# EAGLE schematic hw_DAA (EAGLE 7.6.0), part 2 of 4
## Sheet 14 of 34: SYSMON and PS Config
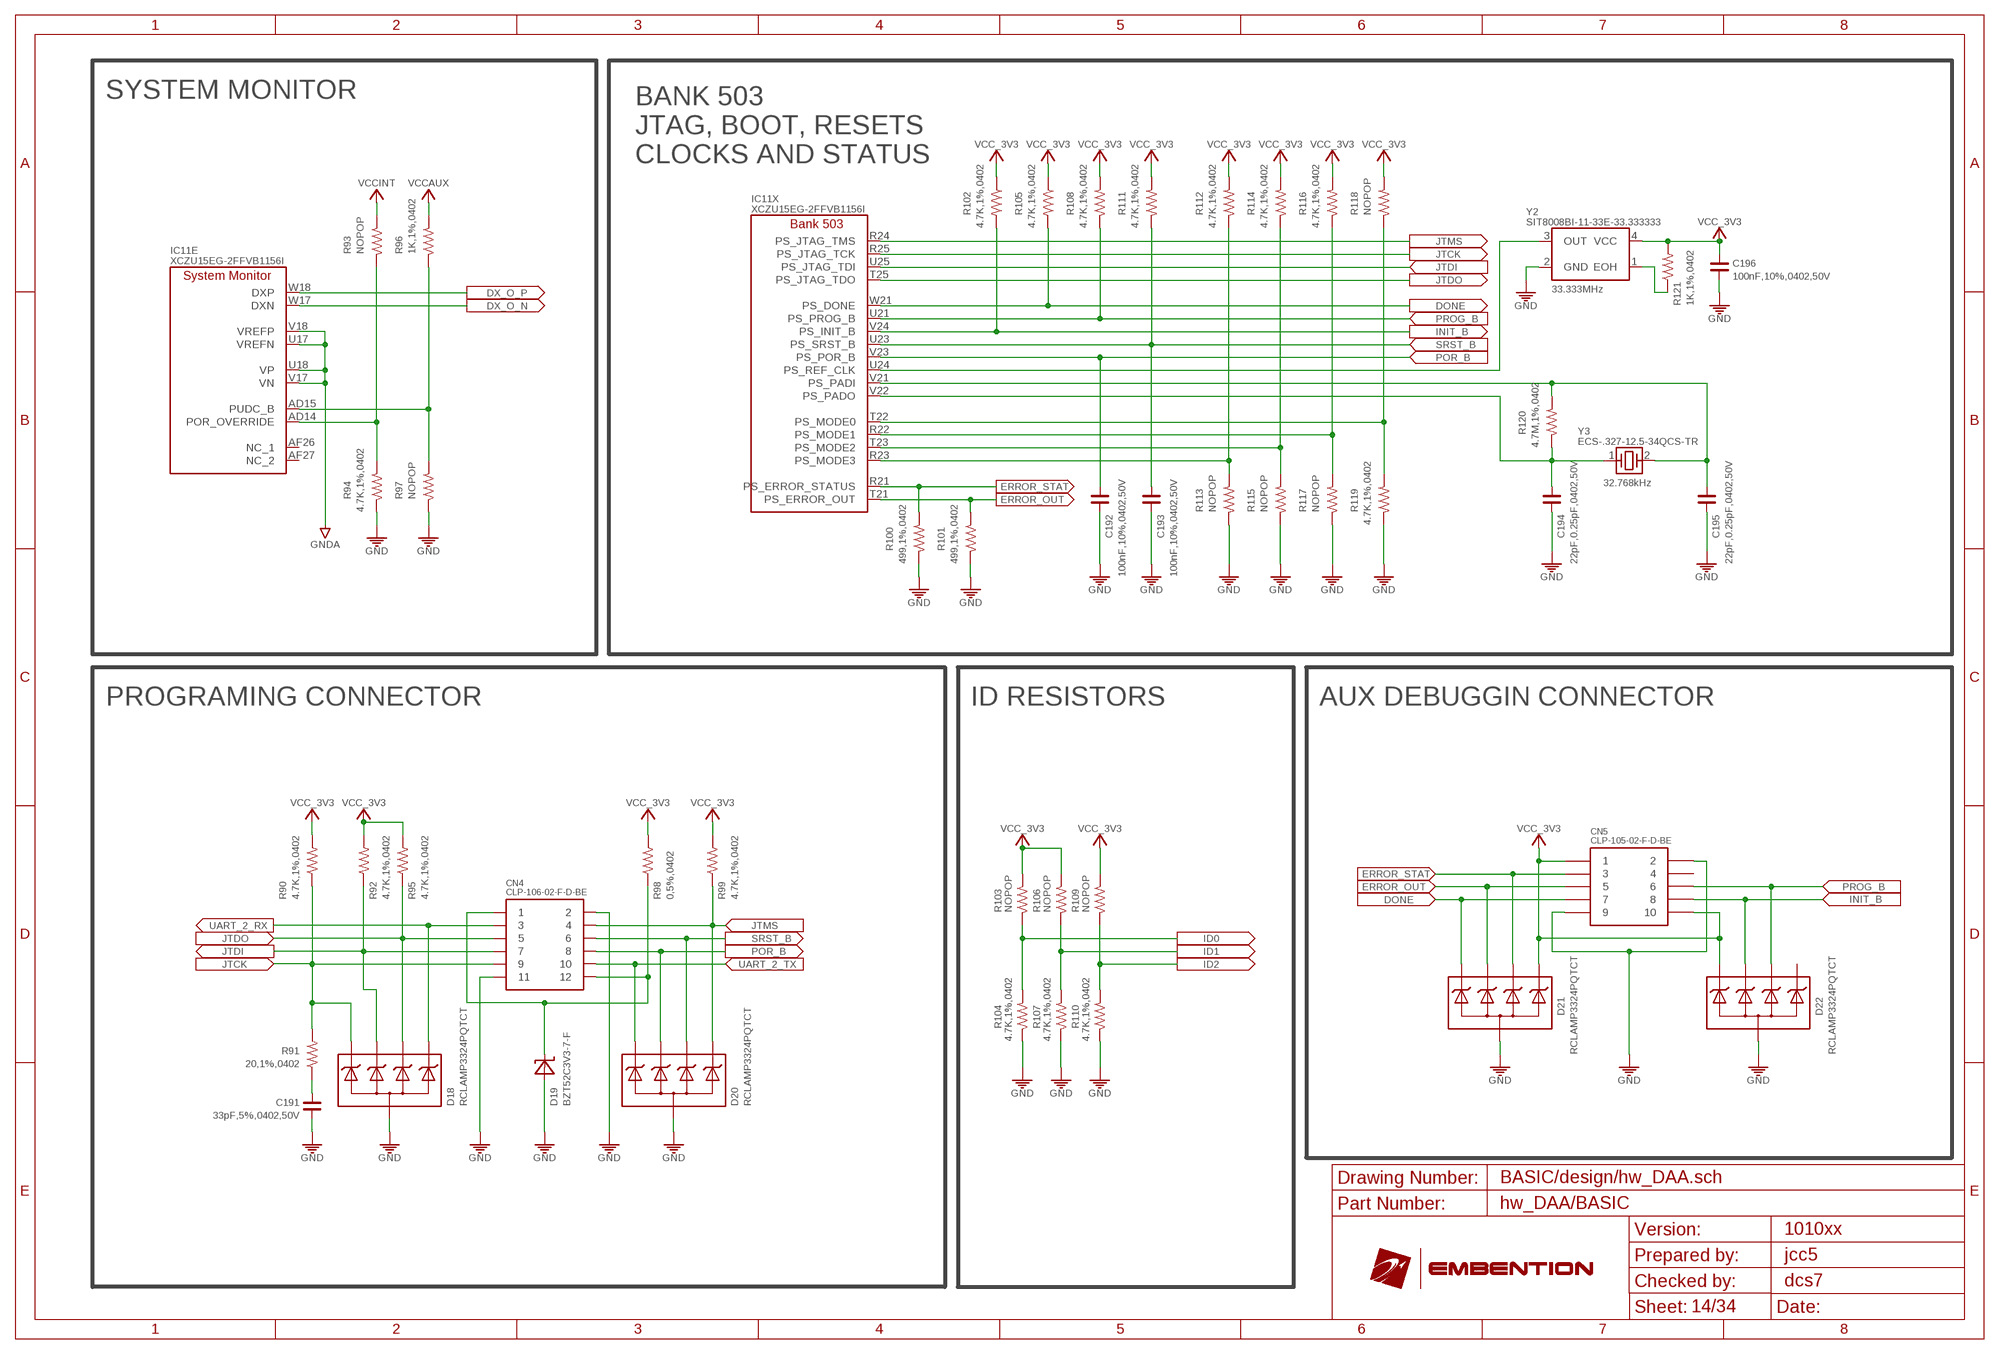
[diagram p13: schematic, sheet 14]

### Parts
C191  33pF,5%,0402,50V  C_0402  [C0402]
C192  100nF,10%,0402,50V  C_0402  [C0402]
C193  100nF,10%,0402,50V  C_0402  [C0402]
C194  22pF,0.25pF,0402,50V  C_0402  [C0402]
C195  22pF,0.25pF,0402,50V  C_0402  [C0402]
C196  100nF,10%,0402,50V  C_0402  [C0402]
CN4  CLP-106-02-F-D-BE  [CLP-106-02-X-D-BE]
CN5  CLP-105-02-F-D-BE  [CLP-105-02-X-D-BE]
D18  RCLAMP3324PQTCT  [USON-10]
D19  BZT52C3V3-7-F  [SOD123]
D20  RCLAMP3324PQTCT  [USON-10]
D21  RCLAMP3324PQTCT  [USON-10]
D22  RCLAMP3324PQTCT  [USON-10]
R90  4.7K,1%,0402  R_0402  [R0402]
R91  20,1%,0402  R_0402  [R0402]
R92  4.7K,1%,0402  R_0402  [R0402]
R93  NOPOP  R_0402  [R0402]
R94  4.7K,1%,0402  R_0402  [R0402]
R95  4.7K,1%,0402  R_0402  [R0402]
R96  1K,1%,0402  R_0402  [R0402]
R97  NOPOP  R_0402  [R0402]
R98  0,5%,0402  R_0402  [R0402]
R99  4.7K,1%,0402  R_0402  [R0402]
R100  499,1%,0402  R_0402  [R0402]
R101  499,1%,0402  R_0402  [R0402]
R102  4.7K,1%,0402  R_0402  [R0402]
R103  NOPOP  R_0402  [R0402]
R104  4.7K,1%,0402  R_0402  [R0402]
R105  4.7K,1%,0402  R_0402  [R0402]
R106  NOPOP  R_0402  [R0402]
R107  4.7K,1%,0402  R_0402  [R0402]
R108  4.7K,1%,0402  R_0402  [R0402]
R109  NOPOP  R_0402  [R0402]
R110  4.7K,1%,0402  R_0402  [R0402]
R111  4.7K,1%,0402  R_0402  [R0402]
R112  4.7K,1%,0402  R_0402  [R0402]
R113  NOPOP  R_0402  [R0402]
R114  4.7K,1%,0402  R_0402  [R0402]
R115  NOPOP  R_0402  [R0402]
R116  4.7K,1%,0402  R_0402  [R0402]
R117  NOPOP  R_0402  [R0402]
R118  NOPOP  R_0402  [R0402]
R119  4.7K,1%,0402  R_0402  [R0402]
R120  4.7M,1%,0402  R_0402  [R0402]
R121  1K,1%,0402  R_0402  [R0402]
Y2  SIT8008BI-11-33E-33.333333  [2.5X2]
Y3  ECS-.327-12.5-34QCS-TR  [3.2X1.5]

### Nets
+3V3_JTAG: CN4.1 CN4.12 D19.C R98.1
DONE: CN5.7 D21.1 D21.10 IC11.W21(X:PS_DONE) R105.2
DX_O_N [TEMP]: IC11.W17(E:DXN) ; also sheet 15
DX_O_P [TEMP]: IC11.W18(E:DXP) ; also sheet 15
ERROR_OUT: CN5.5 D21.2 D21.9 IC11.T21(X:PS_ERROR_OUT) R101.2
ERROR_STAT: CN5.3 D21.4 D21.7 IC11.R21(X:PS_ERROR_STATUS) R100.2
GND: C191.2 C192.2 C193.2 C194.2 C195.2 C196.2 CN4.2 CN4.11 CN5.2 CN5.9 D18.3 D18.8 D18.38 D19.A D20.3 D20.8 D20.38 D21.3 D21.8 D21.38 D22.3 D22.8 D22.38 R94.1 R97.1 R100.1 R101.1 R104.1 R107.1 R110.1 R113.1 R115.1 R117.1 R119.1 Y2.2(GND) ; also sheet 2,3,4,5,6,7,8,9,10,11,12,13,15,17,18,20,21,22,23,24,25,26,27,28,29,30,31,32,33
GNDA: IC11.U17(E:VREFN) IC11.U18(E:VP) IC11.V17(E:VN) IC11.V18(E:VREFP) ; also sheet 11,12,13
ID0: R103.1 R104.2 ; also sheet 19
ID1: R106.1 R107.2 ; also sheet 19
ID2: R109.1 R110.2 ; also sheet 19
INIT_B: CN5.8 D22.2 D22.9 IC11.V24(X:PS_INIT_B) R102.2
JTCK: CN4.9 D18.1 D18.10 IC11.R25(X:PS_JTAG_TCK) R90.1 R91.2
JTDI: CN4.7 D18.2 D18.9 IC11.U25(X:PS_JTAG_TDI) R92.1
JTDO: CN4.5 D18.4 D18.7 IC11.T25(X:PS_JTAG_TDO) R95.1
JTMS: CN4.4 D20.5 D20.6 IC11.R24(X:PS_JTAG_TMS) R99.1
MODE0: IC11.T22(X:PS_MODE0) R118.1 R119.2
MODE1: IC11.R22(X:PS_MODE1) R116.1 R117.2
MODE2: IC11.T23(X:PS_MODE2) R114.1 R115.2
MODE3: IC11.R23(X:PS_MODE3) R112.1 R113.2
N$88: R121.1 Y2.1(EOH)
N$90: C191.1 R91.1
PADI: C195.1 IC11.V21(X:PS_PADI) R120.2 Y3.2(X2)
PADO: C194.1 IC11.V22(X:PS_PADO) R120.1 Y3.1(X1)
POR_B: C192.1 CN4.8 D20.2 D20.9 IC11.V23(X:PS_POR_B) ; also sheet 15
POR_OVERRIDE: IC11.AD14(E:POR_OVERRIDE) R93.1 R94.2
PROG_B: CN5.6 D22.4 D22.7 IC11.U21(X:PS_PROG_B) R108.1
PUDC_B: IC11.AD15(E:PUDC_B) R96.1 R97.2
REF_CLK: IC11.U24(X:PS_REF_CLK) Y2.3(OUT)
SRST_B: C193.1 CN4.6 D20.4 D20.7 IC11.U23(X:PS_SRST_B) R111.1
UART_2_RX: CN4.3 D18.5 D18.6 ; also sheet 17
UART_2_TX: CN4.10 D20.1 D20.10 ; also sheet 17
VCC_3V3: C196.1 CN5.1 CN5.10 D21.5 D21.6 D22.1 D22.10 R90.2 R92.2 R95.2 R98.2 R99.2 R102.1 R103.2 R105.1 R106.2 R108.2 R109.2 R111.2 R112.2 R114.2 R116.2 R118.2 R121.2 Y2.4(VCC) ; also sheet 5,11,12,15
VCCAUX: R96.2 ; also sheet 5,11,12,15
VCCINT: R93.2 ; also sheet 7,11,12
Unconnected: CN5.4 D22.5 D22.6 IC11.AF26(E:NC_1) IC11.AF27(E:NC_2)

### Notes on the sheet
- SYSTEM MONITOR
- BANK 503
  JTAG, BOOT, RESETS
  CLOCKS AND STATUS
- 33.333MHz
- 32.768kHz
- PROGRAMING CONNECTOR | ID RESISTORS | AUX DEBUGGIN CONNECTOR
- BASIC/design/hw_DAA.sch
- hw_DAA/BASIC
- 1010xx
- jcc5
- dcs7

## Sheet 15 of 34: Temperature and Reset
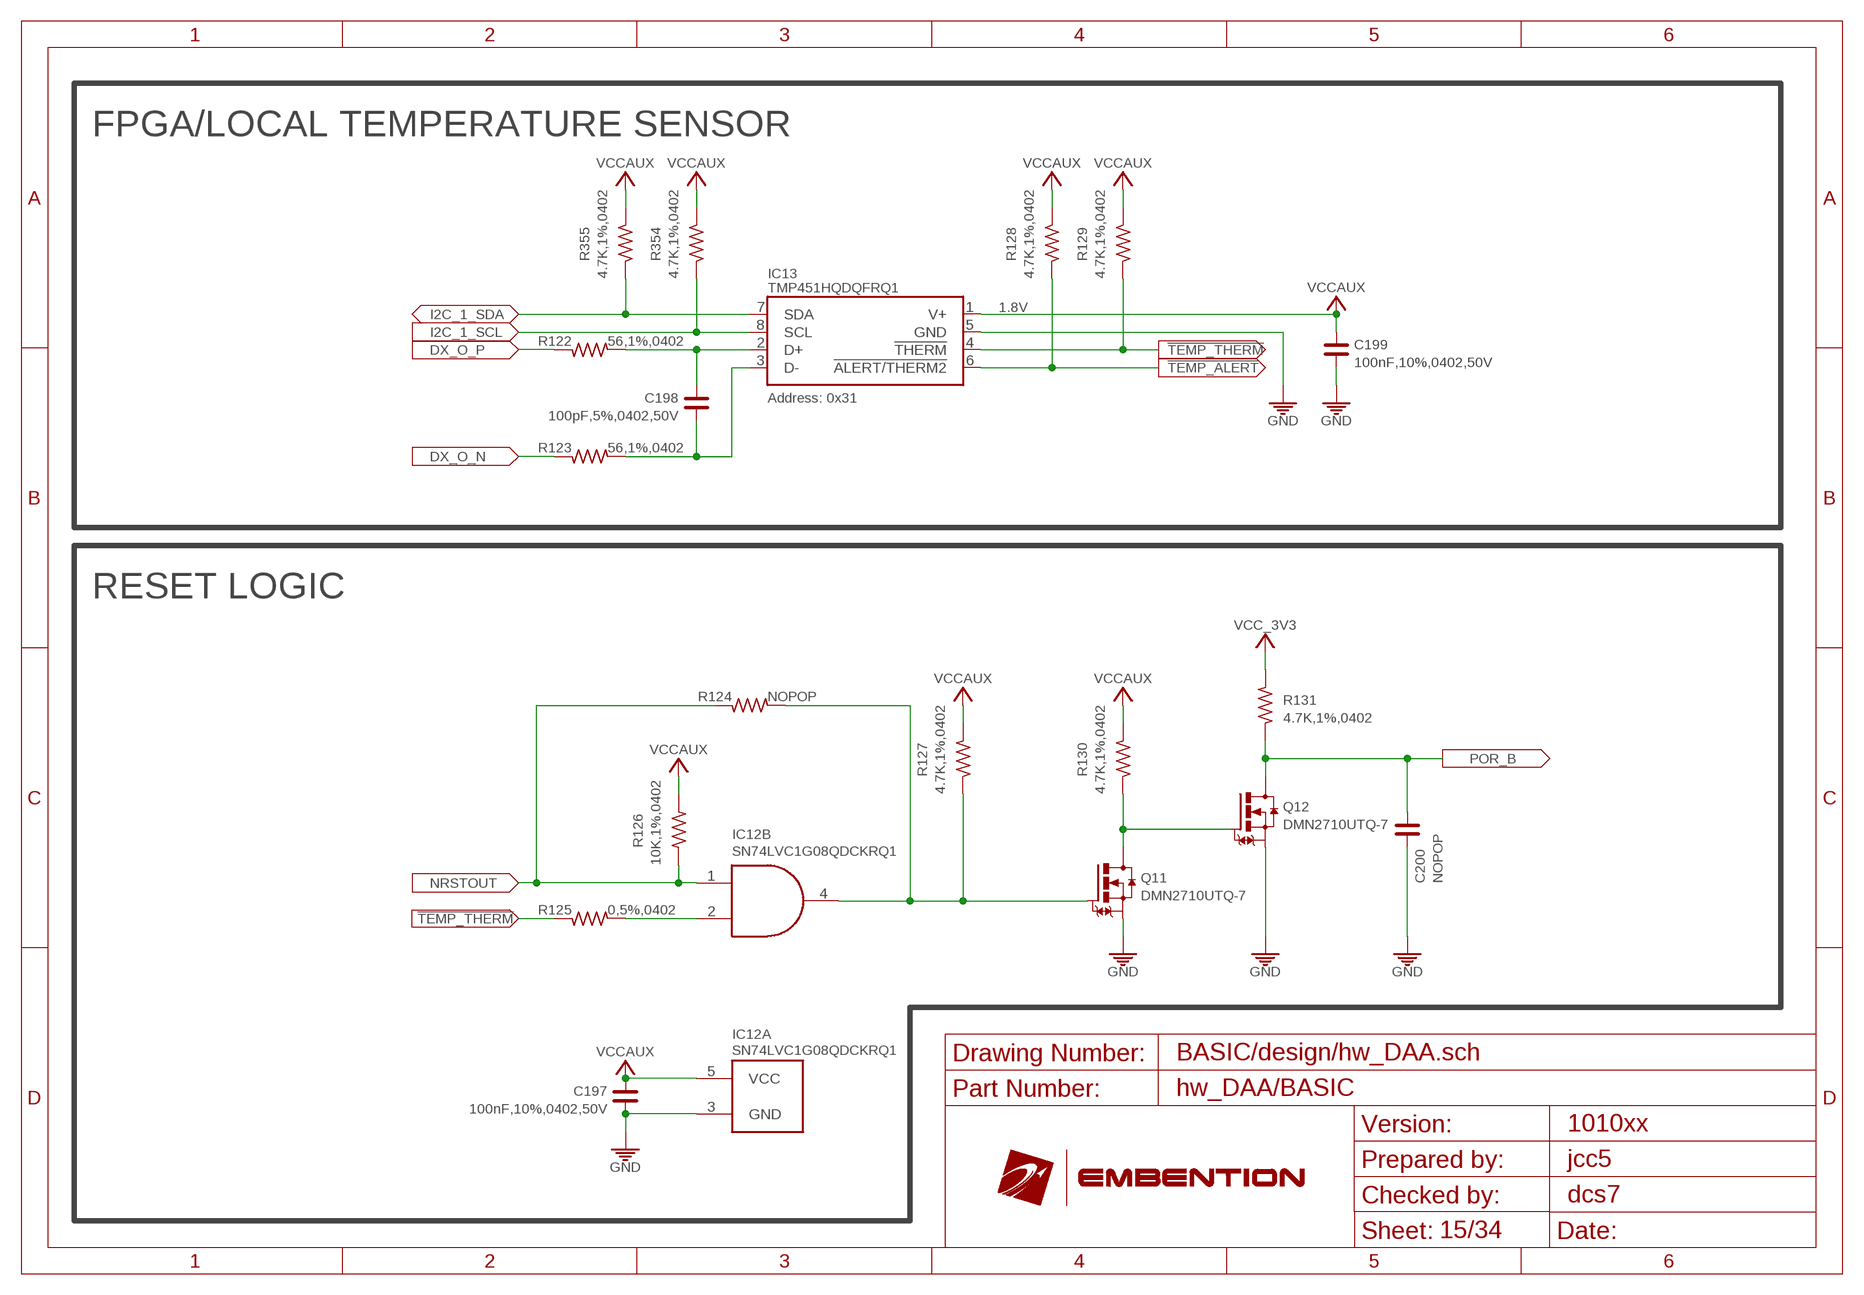
[diagram p14: schematic, sheet 15]

### Parts
C197  100nF,10%,0402,50V  C_0402  [C0402]
C198  100pF,5%,0402,50V  C_0402  [C0402]
C199  100nF,10%,0402,50V  C_0402  [C0402]
C200  NOPOP  C_0402  [C0402]
IC12  SN74LVC1G08QDCKRQ1  [DCK5]
IC13  TMP451HQDQFRQ1  TMP451-Q1  [WSON-8]
Q11  DMN2710UTQ-7  [SOT-523]
Q12  DMN2710UTQ-7  [SOT-523]
R122  56,1%,0402  R_0402  [R0402]
R123  56,1%,0402  R_0402  [R0402]
R124  NOPOP  R_0402  [R0402]
R125  0,5%,0402  R_0402  [R0402]
R126  10K,1%,0402  R_0402  [R0402]
R127  4.7K,1%,0402  R_0402  [R0402]
R128  4.7K,1%,0402  R_0402  [R0402]
R129  4.7K,1%,0402  R_0402  [R0402]
R130  4.7K,1%,0402  R_0402  [R0402]
R131  4.7K,1%,0402  R_0402  [R0402]
R354  4.7K,1%,0402  R_0402  [R0402]
R355  4.7K,1%,0402  R_0402  [R0402]

### Nets
!TEMP_ALERT: IC13.6(!ALERT/THERM2) R128.1 ; also sheet 17
!TEMP_THERM: IC13.4(!THERM) R125.1 R129.1
DX_I_N [TEMP]: C198.2 IC13.3(D-) R123.2
DX_I_P [TEMP]: C198.1 IC13.2(D+) R122.2
DX_O_N [TEMP]: R123.1 ; also sheet 14
DX_O_P [TEMP]: R122.1 ; also sheet 14
GND: C197.2 C199.2 C200.2 IC12.3(A:GND) IC13.5(GND) Q11.2(S) Q12.2(S) ; also sheet 2,3,4,5,6,7,8,9,10,11,12,13,14,17,18,20,21,22,23,24,25,26,27,28,29,30,31,32,33
I2C_1_SCL: IC13.8(SCL) R354.1 ; also sheet 19
I2C_1_SDA: IC13.7(SDA) R355.1 ; also sheet 19
N$18: IC12.2(B:B) R125.2
N$54: Q11.3(D) Q12.1(G) R130.1
N$131: IC12.4(B:Y) Q11.1(G) R124.2 R127.1
NRSTOUT: IC12.1(B:A) R124.1 R126.2 ; also sheet 5,6
POR_B: C200.1 Q12.3(D) R131.2 ; also sheet 14
VCC_3V3: R131.1 ; also sheet 5,11,12,14
VCCAUX: C197.1 C199.1 IC12.5(A:VCC) IC13.1(V+) R126.1 R127.2 R128.2 R129.2 R130.2 R354.2 R355.2 ; also sheet 5,11,12,14

### Notes on the sheet
- FPGA/LOCAL TEMPERATURE SENSOR
- 1.8V
- Address: 0x31
- RESET LOGIC
- BASIC/design/hw_DAA.sch
- hw_DAA/BASIC
- 1010xx
- jcc5
- dcs7

## Sheet 16 of 34: PL High Density Banks
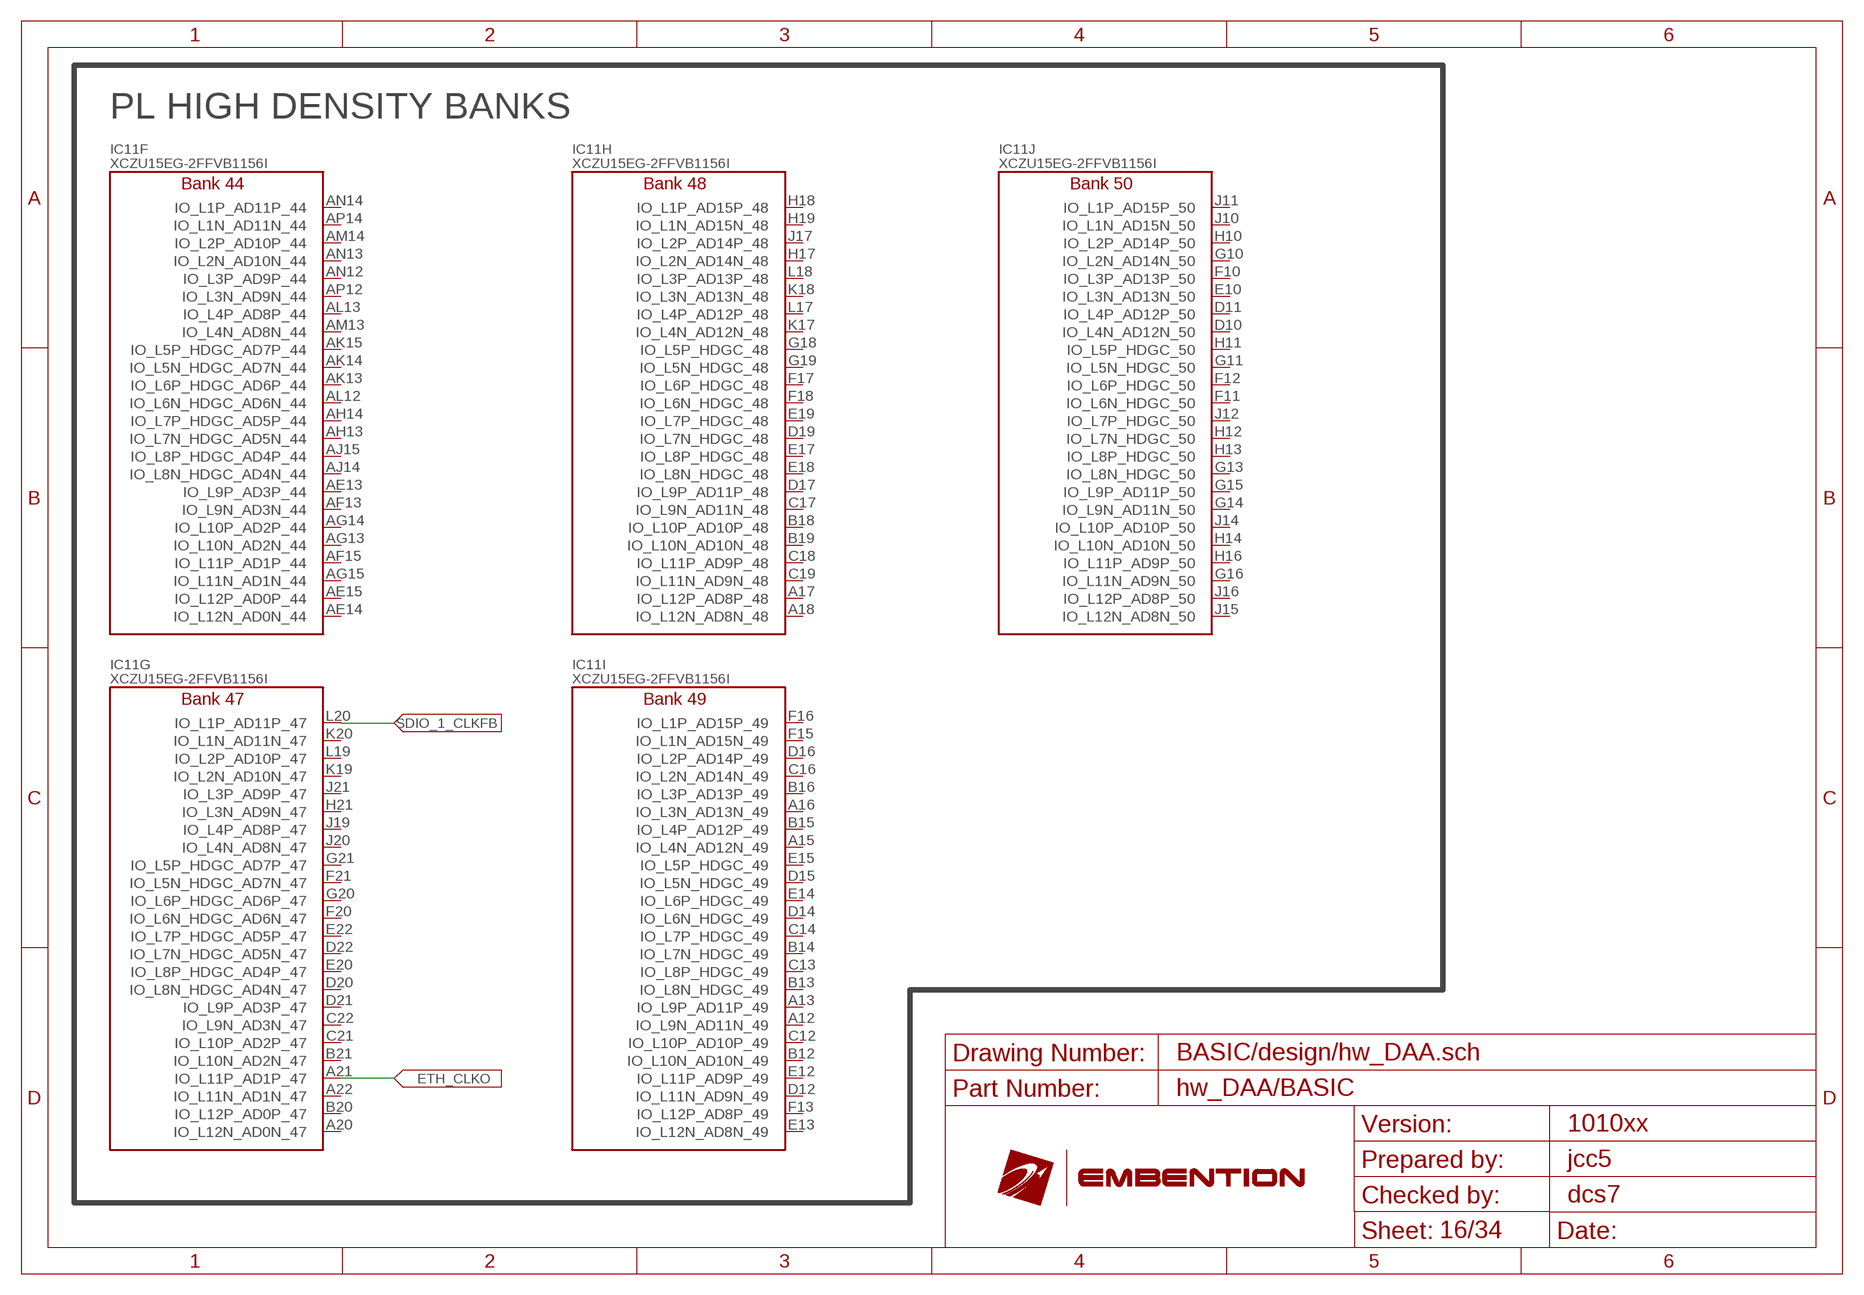
[diagram p15: schematic, sheet 16]

### Nets
ETH_CLKO: IC11.A21(G:IO_L11P_AD1P_47) ; also sheet 27
SDIO_1_CLKFB: IC11.L20(G:IO_L1P_AD11P_47) ; also sheet 24
Unconnected: IC11.A12(I:IO_L9N_AD11N_49) IC11.A13(I:IO_L9P_AD11P_49) IC11.A15(I:IO_L4N_AD12N_49) IC11.A16(I:IO_L3N_AD13N_49) IC11.A17(H:IO_L12P_AD8P_48) IC11.A18(H:IO_L12N_AD8N_48) IC11.A20(G:IO_L12N_AD0N_47) IC11.A22(G:IO_L11N_AD1N_47) IC11.AE13(F:IO_L9P_AD3P_44) IC11.AE14(F:IO_L12N_AD0N_44) IC11.AE15(F:IO_L12P_AD0P_44) IC11.AF13(F:IO_L9N_AD3N_44) IC11.AF15(F:IO_L11P_AD1P_44) IC11.AG13(F:IO_L10N_AD2N_44) IC11.AG14(F:IO_L10P_AD2P_44) IC11.AG15(F:IO_L11N_AD1N_44) IC11.AH13(F:IO_L7N_HDGC_AD5N_44) IC11.AH14(F:IO_L7P_HDGC_AD5P_44) IC11.AJ14(F:IO_L8N_HDGC_AD4N_44) IC11.AJ15(F:IO_L8P_HDGC_AD4P_44) IC11.AK13(F:IO_L6P_HDGC_AD6P_44) IC11.AK14(F:IO_L5N_HDGC_AD7N_44) IC11.AK15(F:IO_L5P_HDGC_AD7P_44) IC11.AL12(F:IO_L6N_HDGC_AD6N_44) IC11.AL13(F:IO_L4P_AD8P_44) IC11.AM13(F:IO_L4N_AD8N_44) IC11.AM14(F:IO_L2P_AD10P_44) IC11.AN12(F:IO_L3P_AD9P_44) IC11.AN13(F:IO_L2N_AD10N_44) IC11.AN14(F:IO_L1P_AD11P_44) IC11.AP12(F:IO_L3N_AD9N_44) IC11.AP14(F:IO_L1N_AD11N_44) IC11.B12(I:IO_L10N_AD10N_49) IC11.B13(I:IO_L8N_HDGC_49) IC11.B14(I:IO_L7N_HDGC_49) IC11.B15(I:IO_L4P_AD12P_49) IC11.B16(I:IO_L3P_AD13P_49) IC11.B18(H:IO_L10P_AD10P_48) IC11.B19(H:IO_L10N_AD10N_48) IC11.B20(G:IO_L12P_AD0P_47) IC11.B21(G:IO_L10N_AD2N_47) IC11.C12(I:IO_L10P_AD10P_49) IC11.C13(I:IO_L8P_HDGC_49) IC11.C14(I:IO_L7P_HDGC_49) IC11.C16(I:IO_L2N_AD14N_49) IC11.C17(H:IO_L9N_AD11N_48) IC11.C18(H:IO_L11P_AD9P_48) IC11.C19(H:IO_L11N_AD9N_48) IC11.C21(G:IO_L10P_AD2P_47) IC11.C22(G:IO_L9N_AD3N_47) IC11.D10(J:IO_L4N_AD12N_50) IC11.D11(J:IO_L4P_AD12P_50) IC11.D12(I:IO_L11N_AD9N_49) IC11.D14(I:IO_L6N_HDGC_49) IC11.D15(I:IO_L5N_HDGC_49) IC11.D16(I:IO_L2P_AD14P_49) IC11.D17(H:IO_L9P_AD11P_48) IC11.D19(H:IO_L7N_HDGC_48) IC11.D20(G:IO_L8N_HDGC_AD4N_47) IC11.D21(G:IO_L9P_AD3P_47) IC11.D22(G:IO_L7N_HDGC_AD5N_47) IC11.E10(J:IO_L3N_AD13N_50) IC11.E12(I:IO_L11P_AD9P_49) IC11.E13(I:IO_L12N_AD8N_49) IC11.E14(I:IO_L6P_HDGC_49) IC11.E15(I:IO_L5P_HDGC_49) IC11.E17(H:IO_L8P_HDGC_48) IC11.E18(H:IO_L8N_HDGC_48) IC11.E19(H:IO_L7P_HDGC_48) IC11.E20(G:IO_L8P_HDGC_AD4P_47) IC11.E22(G:IO_L7P_HDGC_AD5P_47) IC11.F10(J:IO_L3P_AD13P_50) IC11.F11(J:IO_L6N_HDGC_50) IC11.F12(J:IO_L6P_HDGC_50) IC11.F13(I:IO_L12P_AD8P_49) IC11.F15(I:IO_L1N_AD15N_49) IC11.F16(I:IO_L1P_AD15P_49) IC11.F17(H:IO_L6P_HDGC_48) IC11.F18(H:IO_L6N_HDGC_48) IC11.F20(G:IO_L6N_HDGC_AD6N_47) IC11.F21(G:IO_L5N_HDGC_AD7N_47) IC11.G10(J:IO_L2N_AD14N_50) IC11.G11(J:IO_L5N_HDGC_50) IC11.G13(J:IO_L8N_HDGC_50) IC11.G14(J:IO_L9N_AD11N_50) IC11.G15(J:IO_L9P_AD11P_50) IC11.G16(J:IO_L11N_AD9N_50) IC11.G18(H:IO_L5P_HDGC_48) IC11.G19(H:IO_L5N_HDGC_48) IC11.G20(G:IO_L6P_HDGC_AD6P_47) IC11.G21(G:IO_L5P_HDGC_AD7P_47) IC11.H10(J:IO_L2P_AD14P_50) IC11.H11(J:IO_L5P_HDGC_50) IC11.H12(J:IO_L7N_HDGC_50) IC11.H13(J:IO_L8P_HDGC_50) IC11.H14(J:IO_L10N_AD10N_50) IC11.H16(J:IO_L11P_AD9P_50) IC11.H17(H:IO_L2N_AD14N_48) IC11.H18(H:IO_L1P_AD15P_48) IC11.H19(H:IO_L1N_AD15N_48) IC11.H21(G:IO_L3N_AD9N_47) IC11.J10(J:IO_L1N_AD15N_50) IC11.J11(J:IO_L1P_AD15P_50) IC11.J12(J:IO_L7P_HDGC_50) IC11.J14(J:IO_L10P_AD10P_50) IC11.J15(J:IO_L12N_AD8N_50) IC11.J16(J:IO_L12P_AD8P_50) IC11.J17(H:IO_L2P_AD14P_48) IC11.J19(G:IO_L4P_AD8P_47) IC11.J20(G:IO_L4N_AD8N_47) IC11.J21(G:IO_L3P_AD9P_47) IC11.K17(H:IO_L4N_AD12N_48) IC11.K18(H:IO_L3N_AD13N_48) IC11.K19(G:IO_L2N_AD10N_47) IC11.K20(G:IO_L1N_AD11N_47) IC11.L17(H:IO_L4P_AD12P_48) IC11.L18(H:IO_L3P_AD13P_48) IC11.L19(G:IO_L2P_AD10P_47)

### Notes on the sheet
- PL HIGH DENSITY BANKS
- BASIC/design/hw_DAA.sch
- hw_DAA/BASIC
- 1010xx
- jcc5
- dcs7

## Sheet 17 of 34: PL High Performance Banks
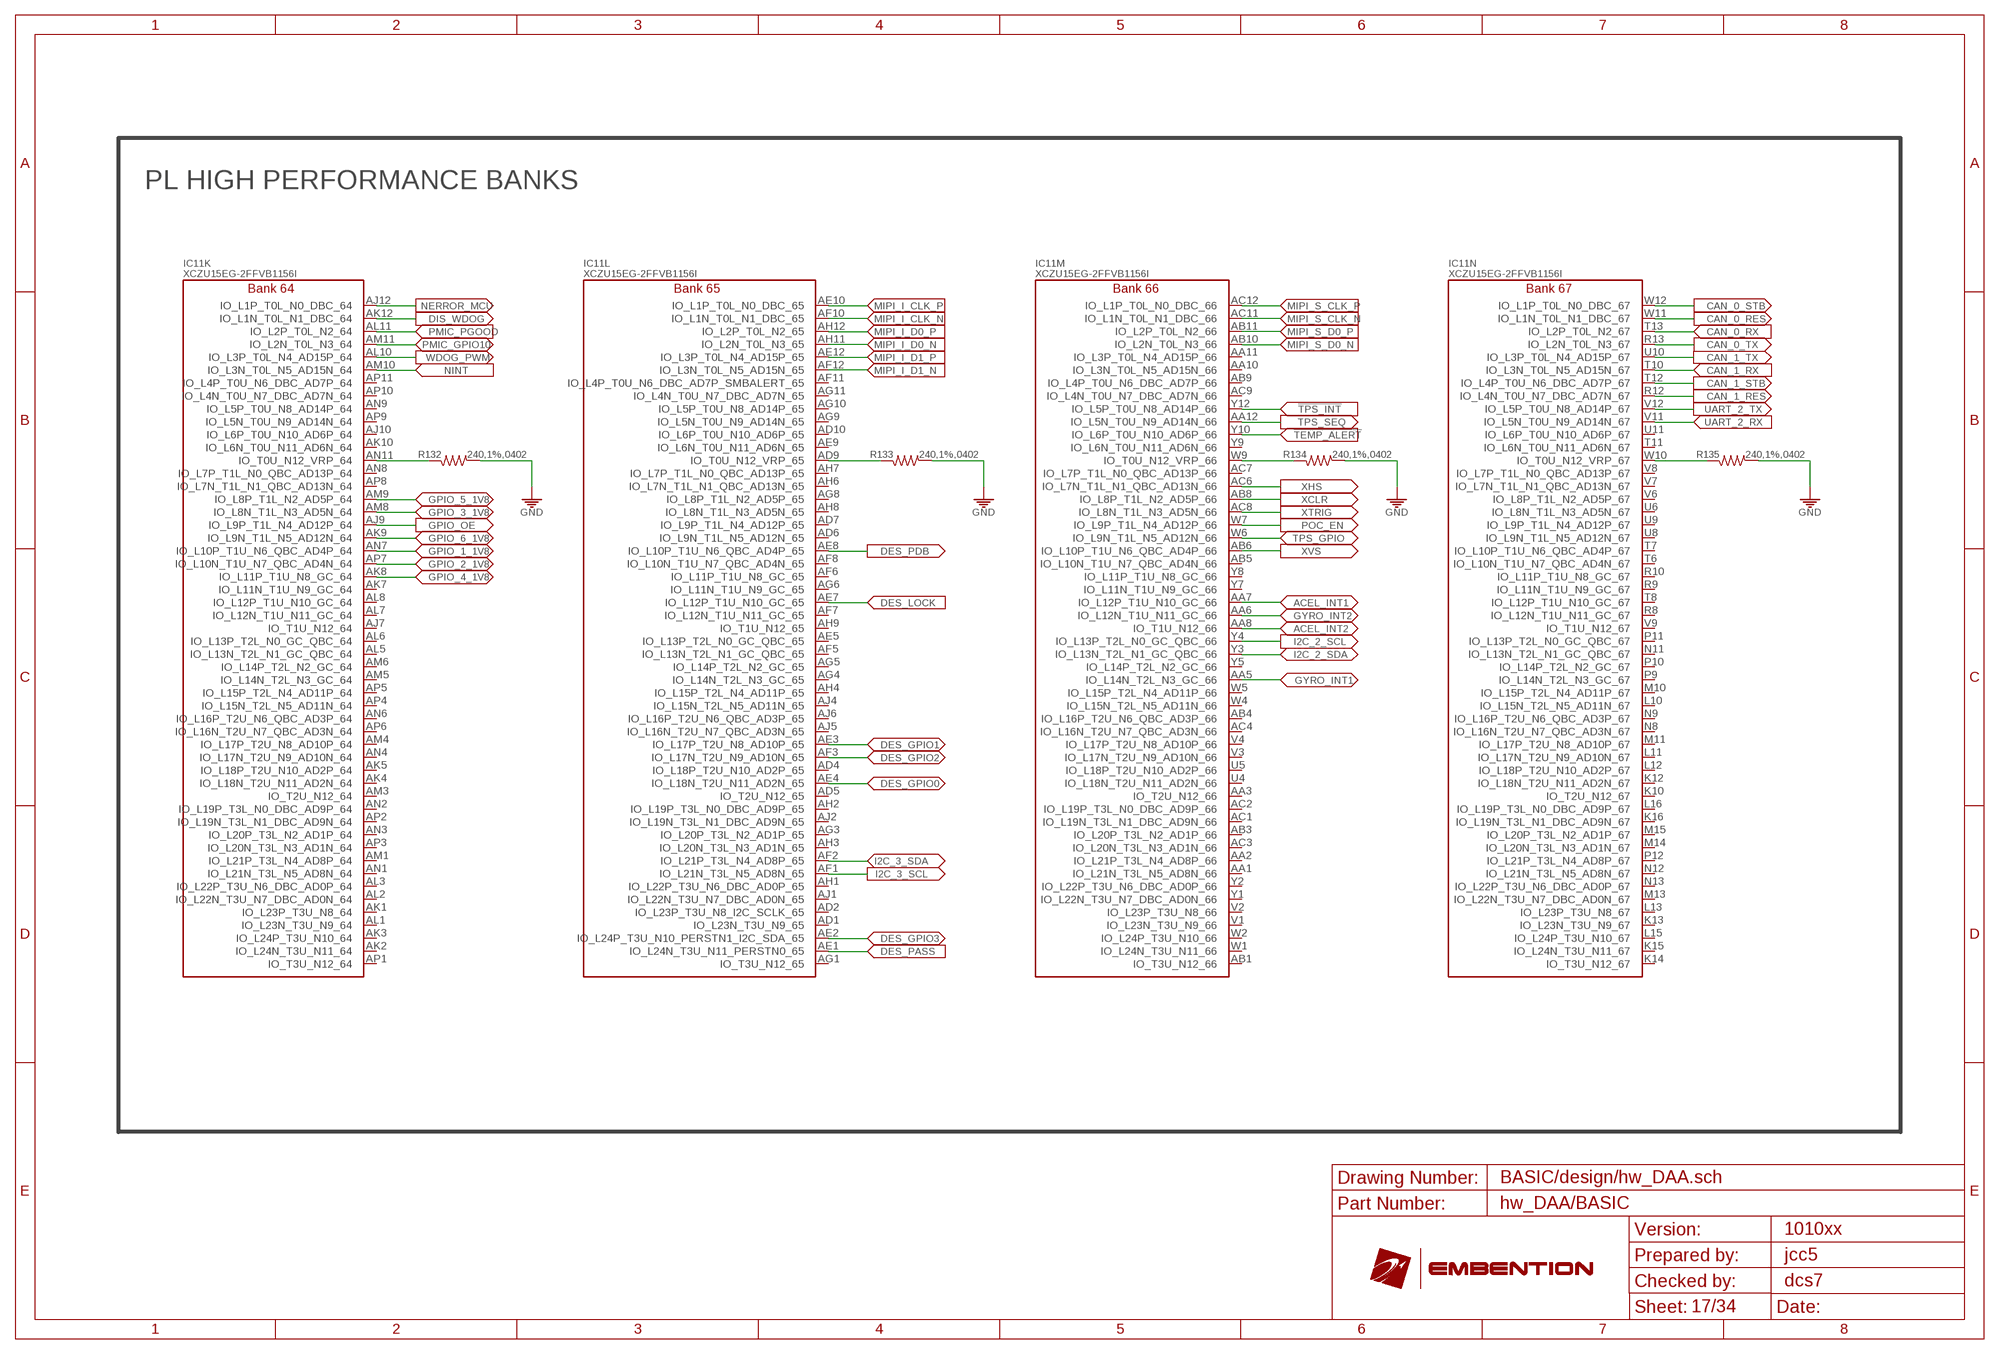
[diagram p16: schematic, sheet 17]

### Parts
R132  240,1%,0402  R_0402  [R0402]
R133  240,1%,0402  R_0402  [R0402]
R134  240,1%,0402  R_0402  [R0402]
R135  240,1%,0402  R_0402  [R0402]

### Nets
!TEMP_ALERT: IC11.Y10(M:IO_L6P_T0U_N10_AD6P_66) ; also sheet 15
!TPS_INT: IC11.Y12(M:IO_L5P_T0U_N8_AD14P_66) ; also sheet 9
ACEL_INT1: IC11.AA7(M:IO_L12P_T1U_N10_GC_66) ; also sheet 30
ACEL_INT2: IC11.AA8(M:IO_T1U_N12_66) ; also sheet 30
CAN_0_RES: IC11.W11(N:IO_L1N_T0L_N1_DBC_67) ; also sheet 25
CAN_0_RX: IC11.T13(N:IO_L2P_T0L_N2_67) ; also sheet 25
CAN_0_STB: IC11.W12(N:IO_L1P_T0L_N0_DBC_67) ; also sheet 25
CAN_0_TX: IC11.R13(N:IO_L2N_T0L_N3_67) ; also sheet 25
CAN_1_RES: IC11.R12(N:IO_L4N_T0U_N7_DBC_AD7N_67) ; also sheet 25
CAN_1_RX: IC11.T10(N:IO_L3N_T0L_N5_AD15N_67) ; also sheet 25
CAN_1_STB: IC11.T12(N:IO_L4P_T0U_N6_DBC_AD7P_67) ; also sheet 25
CAN_1_TX: IC11.U10(N:IO_L3P_T0L_N4_AD15P_67) ; also sheet 25
DES_GPIO0: IC11.AE4(L:IO_L18N_T2U_N11_AD2N_65) ; also sheet 32
DES_GPIO1: IC11.AE3(L:IO_L17P_T2U_N8_AD10P_65) ; also sheet 32
DES_GPIO2: IC11.AF3(L:IO_L17N_T2U_N9_AD10N_65) ; also sheet 32
DES_GPIO3: IC11.AE2(L:IO_L24P_T3U_N10_PERSTN1_I2C_SDA_65) ; also sheet 32
DES_LOCK: IC11.AE7(L:IO_L12P_T1U_N10_GC_65) ; also sheet 32
DES_PASS: IC11.AE1(L:IO_L24N_T3U_N11_PERSTN0_65) ; also sheet 32
DES_PDB: IC11.AE8(L:IO_L10P_T1U_N6_QBC_AD4P_65) ; also sheet 32
DIS_WDOG: IC11.AK12(K:IO_L1N_T0L_N1_DBC_64) ; also sheet 5
GND: R132.1 R133.1 R134.1 R135.1 ; also sheet 2,3,4,5,6,7,8,9,10,11,12,13,14,15,18,20,21,22,23,24,25,26,27,28,29,30,31,32,33
GPIO_1_1V8: IC11.AN7(K:IO_L10P_T1U_N6_QBC_AD4P_64) ; also sheet 33
GPIO_2_1V8: IC11.AP7(K:IO_L10N_T1U_N7_QBC_AD4N_64) ; also sheet 33
GPIO_3_1V8: IC11.AM8(K:IO_L8N_T1L_N3_AD5N_64) ; also sheet 33
GPIO_4_1V8: IC11.AK8(K:IO_L11P_T1U_N8_GC_64) ; also sheet 33
GPIO_5_1V8: IC11.AM9(K:IO_L8P_T1L_N2_AD5P_64) ; also sheet 33
GPIO_6_1V8: IC11.AK9(K:IO_L9N_T1L_N5_AD12N_64) ; also sheet 33
GPIO_OE: IC11.AJ9(K:IO_L9P_T1L_N4_AD12P_64) ; also sheet 33
GYRO_INT1: IC11.AA5(M:IO_L14N_T2L_N3_GC_66) ; also sheet 30
GYRO_INT2: IC11.AA6(M:IO_L12N_T1U_N11_GC_66) ; also sheet 30
I2C_2_SCL: IC11.Y4(M:IO_L13P_T2L_N0_GC_QBC_66) ; also sheet 29
I2C_2_SDA: IC11.Y3(M:IO_L13N_T2L_N1_GC_QBC_66) ; also sheet 29
I2C_3_SCL: IC11.AF1(L:IO_L21N_T3L_N5_AD8N_65) ; also sheet 32
I2C_3_SDA: IC11.AF2(L:IO_L21P_T3L_N4_AD8P_65) ; also sheet 32
MIPI_I_CLK_N [DIFF100]: IC11.AF10(L:IO_L1N_T0L_N1_DBC_65) ; also sheet 32
MIPI_I_CLK_P [DIFF100]: IC11.AE10(L:IO_L1P_T0L_N0_DBC_65) ; also sheet 32
MIPI_I_D0_N [DIFF100]: IC11.AH11(L:IO_L2N_T0L_N3_65) ; also sheet 32
MIPI_I_D0_P [DIFF100]: IC11.AH12(L:IO_L2P_T0L_N2_65) ; also sheet 32
MIPI_I_D1_N [DIFF100]: IC11.AF12(L:IO_L3N_T0L_N5_AD15N_65) ; also sheet 32
MIPI_I_D1_P [DIFF100]: IC11.AE12(L:IO_L3P_T0L_N4_AD15P_65) ; also sheet 32
MIPI_S_CLK_N [DIFF100]: IC11.AC11(M:IO_L1N_T0L_N1_DBC_66) ; also sheet 29
MIPI_S_CLK_P [DIFF100]: IC11.AC12(M:IO_L1P_T0L_N0_DBC_66) ; also sheet 29
MIPI_S_D0_N [DIFF100]: IC11.AB10(M:IO_L2N_T0L_N3_66) ; also sheet 29
MIPI_S_D0_P [DIFF100]: IC11.AB11(M:IO_L2P_T0L_N2_66) ; also sheet 29
NERROR_MCU: IC11.AJ12(K:IO_L1P_T0L_N0_DBC_64) ; also sheet 5
NINT: IC11.AM10(K:IO_L3N_T0L_N5_AD15N_64) ; also sheet 5,6
PMIC_GPIO10: IC11.AM11(K:IO_L2N_T0L_N3_64) ; also sheet 5
PMIC_PGOOD: IC11.AL11(K:IO_L2P_T0L_N2_64) ; also sheet 5
POC_EN: IC11.W7(M:IO_L9P_T1L_N4_AD12P_66) ; also sheet 3
TPS_GPIO: IC11.W6(M:IO_L9N_T1L_N5_AD12N_66) ; also sheet 9
TPS_SEQ: IC11.AA12(M:IO_L5N_T0U_N9_AD14N_66) ; also sheet 9
UART_2_RX: IC11.V11(N:IO_L5N_T0U_N9_AD14N_67) ; also sheet 14
UART_2_TX: IC11.V12(N:IO_L5P_T0U_N8_AD14P_67) ; also sheet 14
VRP_BK64: IC11.AN11(K:IO_T0U_N12_VRP_64) R132.2
VRP_BK65: IC11.AD9(L:IO_T0U_N12_VRP_65) R133.2
VRP_BK66: IC11.W9(M:IO_T0U_N12_VRP_66) R134.2
VRP_BK67: IC11.W10(N:IO_T0U_N12_VRP_67) R135.2
WDOG_PWM: IC11.AL10(K:IO_L3P_T0L_N4_AD15P_64) ; also sheet 5
XCLR: IC11.AB8(M:IO_L8P_T1L_N2_AD5P_66) ; also sheet 29
XHS: IC11.AC6(M:IO_L7N_T1L_N1_QBC_AD13N_66) ; also sheet 29
XTRIG: IC11.AC8(M:IO_L8N_T1L_N3_AD5N_66) ; also sheet 29
XVS: IC11.AB6(M:IO_L10P_T1U_N6_QBC_AD4P_66) ; also sheet 29
Unconnected: IC11.AA1(M:IO_L21N_T3L_N5_AD8N_66) IC11.AA2(M:IO_L21P_T3L_N4_AD8P_66) IC11.AA3(M:IO_T2U_N12_66) IC11.AA10(M:IO_L3N_T0L_N5_AD15N_66) IC11.AA11(M:IO_L3P_T0L_N4_AD15P_66) IC11.AB1(M:IO_T3U_N12_66) IC11.AB3(M:IO_L20P_T3L_N2_AD1P_66) IC11.AB4(M:IO_L16P_T2U_N6_QBC_AD3P_66) IC11.AB5(M:IO_L10N_T1U_N7_QBC_AD4N_66) IC11.AB9(M:IO_L4P_T0U_N6_DBC_AD7P_66) IC11.AC1(M:IO_L19N_T3L_N1_DBC_AD9N_66) IC11.AC2(M:IO_L19P_T3L_N0_DBC_AD9P_66) IC11.AC3(M:IO_L20N_T3L_N3_AD1N_66) IC11.AC4(M:IO_L16N_T2U_N7_QBC_AD3N_66) IC11.AC7(M:IO_L7P_T1L_N0_QBC_AD13P_66) IC11.AC9(M:IO_L4N_T0U_N7_DBC_AD7N_66) IC11.AD1(L:IO_L23N_T3U_N9_65) IC11.AD2(L:IO_L23P_T3U_N8_I2C_SCLK_65) IC11.AD4(L:IO_L18P_T2U_N10_AD2P_65) IC11.AD5(L:IO_T2U_N12_65) IC11.AD6(L:IO_L9N_T1L_N5_AD12N_65) IC11.AD7(L:IO_L9P_T1L_N4_AD12P_65) IC11.AD10(L:IO_L6P_T0U_N10_AD6P_65) IC11.AE5(L:IO_L13P_T2L_N0_GC_QBC_65) IC11.AE9(L:IO_L6N_T0U_N11_AD6N_65) IC11.AF5(L:IO_L13N_T2L_N1_GC_QBC_65) IC11.AF6(L:IO_L11P_T1U_N8_GC_65) IC11.AF7(L:IO_L12N_T1U_N11_GC_65) IC11.AF8(L:IO_L10N_T1U_N7_QBC_AD4N_65) IC11.AF11(L:IO_L4P_T0U_N6_DBC_AD7P_SMBALERT_65) IC11.AG1(L:IO_T3U_N12_65) IC11.AG3(L:IO_L20P_T3L_N2_AD1P_65) IC11.AG4(L:IO_L14N_T2L_N3_GC_65) IC11.AG5(L:IO_L14P_T2L_N2_GC_65) IC11.AG6(L:IO_L11N_T1U_N9_GC_65) IC11.AG8(L:IO_L8P_T1L_N2_AD5P_65) IC11.AG9(L:IO_L5N_T0U_N9_AD14N_65) IC11.AG10(L:IO_L5P_T0U_N8_AD14P_65) IC11.AG11(L:IO_L4N_T0U_N7_DBC_AD7N_65) IC11.AH1(L:IO_L22P_T3U_N6_DBC_AD0P_65) IC11.AH2(L:IO_L19P_T3L_N0_DBC_AD9P_65) IC11.AH3(L:IO_L20N_T3L_N3_AD1N_65) IC11.AH4(L:IO_L15P_T2L_N4_AD11P_65) IC11.AH6(L:IO_L7N_T1L_N1_QBC_AD13N_65) IC11.AH7(L:IO_L7P_T1L_N0_QBC_AD13P_65) IC11.AH8(L:IO_L8N_T1L_N3_AD5N_65) IC11.AH9(L:IO_T1U_N12_65) IC11.AJ1(L:IO_L22N_T3U_N7_DBC_AD0N_65) IC11.AJ2(L:IO_L19N_T3L_N1_DBC_AD9N_65) IC11.AJ4(L:IO_L15N_T2L_N5_AD11N_65) IC11.AJ5(L:IO_L16N_T2U_N7_QBC_AD3N_65) IC11.AJ6(L:IO_L16P_T2U_N6_QBC_AD3P_65) IC11.AJ7(K:IO_T1U_N12_64) IC11.AJ10(K:IO_L6P_T0U_N10_AD6P_64) IC11.AK1(K:IO_L23P_T3U_N8_64) IC11.AK2(K:IO_L24N_T3U_N11_64) IC11.AK3(K:IO_L24P_T3U_N10_64) IC11.AK4(K:IO_L18N_T2U_N11_AD2N_64) IC11.AK5(K:IO_L18P_T2U_N10_AD2P_64) IC11.AK7(K:IO_L11N_T1U_N9_GC_64) IC11.AK10(K:IO_L6N_T0U_N11_AD6N_64) IC11.AL1(K:IO_L23N_T3U_N9_64) IC11.AL2(K:IO_L22N_T3U_N7_DBC_AD0N_64) IC11.AL3(K:IO_L22P_T3U_N6_DBC_AD0P_64) IC11.AL5(K:IO_L13N_T2L_N1_GC_QBC_64) IC11.AL6(K:IO_L13P_T2L_N0_GC_QBC_64) IC11.AL7(K:IO_L12N_T1U_N11_GC_64) IC11.AL8(K:IO_L12P_T1U_N10_GC_64) IC11.AM1(K:IO_L21P_T3L_N4_AD8P_64) IC11.AM3(K:IO_T2U_N12_64) IC11.AM4(K:IO_L17P_T2U_N8_AD10P_64) IC11.AM5(K:IO_L14N_T2L_N3_GC_64) IC11.AM6(K:IO_L14P_T2L_N2_GC_64) IC11.AN1(K:IO_L21N_T3L_N5_AD8N_64) IC11.AN2(K:IO_L19P_T3L_N0_DBC_AD9P_64) IC11.AN3(K:IO_L20P_T3L_N2_AD1P_64) IC11.AN4(K:IO_L17N_T2U_N9_AD10N_64) IC11.AN6(K:IO_L16P_T2U_N6_QBC_AD3P_64) IC11.AN8(K:IO_L7P_T1L_N0_QBC_AD13P_64) IC11.AN9(K:IO_L5P_T0U_N8_AD14P_64) IC11.AP1(K:IO_T3U_N12_64) IC11.AP2(K:IO_L19N_T3L_N1_DBC_AD9N_64) IC11.AP3(K:IO_L20N_T3L_N3_AD1N_64) IC11.AP4(K:IO_L15N_T2L_N5_AD11N_64) IC11.AP5(K:IO_L15P_T2L_N4_AD11P_64) IC11.AP6(K:IO_L16N_T2U_N7_QBC_AD3N_64) IC11.AP8(K:IO_L7N_T1L_N1_QBC_AD13N_64) IC11.AP9(K:IO_L5N_T0U_N9_AD14N_64) IC11.AP10(K:IO_L4N_T0U_N7_DBC_AD7N_64) IC11.AP11(K:IO_L4P_T0U_N6_DBC_AD7P_64) IC11.K10(N:IO_T2U_N12_67) IC11.K12(N:IO_L18N_T2U_N11_AD2N_67) IC11.K13(N:IO_L23N_T3U_N9_67) IC11.K14(N:IO_T3U_N12_67) IC11.K15(N:IO_L24N_T3U_N11_67) IC11.K16(N:IO_L19N_T3L_N1_DBC_AD9N_67) IC11.L10(N:IO_L15N_T2L_N5_AD11N_67) IC11.L11(N:IO_L17N_T2U_N9_AD10N_67) IC11.L12(N:IO_L18P_T2U_N10_AD2P_67) IC11.L13(N:IO_L23P_T3U_N8_67) IC11.L15(N:IO_L24P_T3U_N10_67) IC11.L16(N:IO_L19P_T3L_N0_DBC_AD9P_67) IC11.M10(N:IO_L15P_T2L_N4_AD11P_67) IC11.M11(N:IO_L17P_T2U_N8_AD10P_67) IC11.M13(N:IO_L22N_T3U_N7_DBC_AD0N_67) IC11.M14(N:IO_L20N_T3L_N3_AD1N_67) IC11.M15(N:IO_L20P_T3L_N2_AD1P_67) IC11.N8(N:IO_L16N_T2U_N7_QBC_AD3N_67) IC11.N9(N:IO_L16P_T2U_N6_QBC_AD3P_67) IC11.N11(N:IO_L13N_T2L_N1_GC_QBC_67) IC11.N12(N:IO_L21N_T3L_N5_AD8N_67) IC11.N13(N:IO_L22P_T3U_N6_DBC_AD0P_67) IC11.P9(N:IO_L14N_T2L_N3_GC_67) IC11.P10(N:IO_L14P_T2L_N2_GC_67) IC11.P11(N:IO_L13P_T2L_N0_GC_QBC_67) IC11.P12(N:IO_L21P_T3L_N4_AD8P_67) IC11.R8(N:IO_L12N_T1U_N11_GC_67) IC11.R9(N:IO_L11N_T1U_N9_GC_67) IC11.R10(N:IO_L11P_T1U_N8_GC_67) IC11.T6(N:IO_L10N_T1U_N7_QBC_AD4N_67) IC11.T7(N:IO_L10P_T1U_N6_QBC_AD4P_67) IC11.T8(N:IO_L12P_T1U_N10_GC_67) IC11.T11(N:IO_L6N_T0U_N11_AD6N_67) IC11.U4(M:IO_L18N_T2U_N11_AD2N_66) IC11.U5(M:IO_L18P_T2U_N10_AD2P_66) IC11.U6(N:IO_L8N_T1L_N3_AD5N_67) IC11.U8(N:IO_L9N_T1L_N5_AD12N_67) IC11.U9(N:IO_L9P_T1L_N4_AD12P_67) IC11.U11(N:IO_L6P_T0U_N10_AD6P_67) IC11.V1(M:IO_L23N_T3U_N9_66) IC11.V2(M:IO_L23P_T3U_N8_66) IC11.V3(M:IO_L17N_T2U_N9_AD10N_66) IC11.V4(M:IO_L17P_T2U_N8_AD10P_66) IC11.V6(N:IO_L8P_T1L_N2_AD5P_67) IC11.V7(N:IO_L7N_T1L_N1_QBC_AD13N_67) IC11.V8(N:IO_L7P_T1L_N0_QBC_AD13P_67) IC11.V9(N:IO_T1U_N12_67) IC11.W1(M:IO_L24N_T3U_N11_66) IC11.W2(M:IO_L24P_T3U_N10_66) IC11.W4(M:IO_L15N_T2L_N5_AD11N_66) IC11.W5(M:IO_L15P_T2L_N4_AD11P_66) IC11.Y1(M:IO_L22N_T3U_N7_DBC_AD0N_66) IC11.Y2(M:IO_L22P_T3U_N6_DBC_AD0P_66) IC11.Y5(M:IO_L14P_T2L_N2_GC_66) IC11.Y7(M:IO_L11N_T1U_N9_GC_66) IC11.Y8(M:IO_L11P_T1U_N8_GC_66) IC11.Y9(M:IO_L6N_T0U_N11_AD6N_66)

### Notes on the sheet
- PL HIGH PERFORMANCE BANKS
- BASIC/design/hw_DAA.sch
- hw_DAA/BASIC
- 1010xx
- jcc5
- dcs7

## Sheet 18 of 34: PS Transcievers Bank
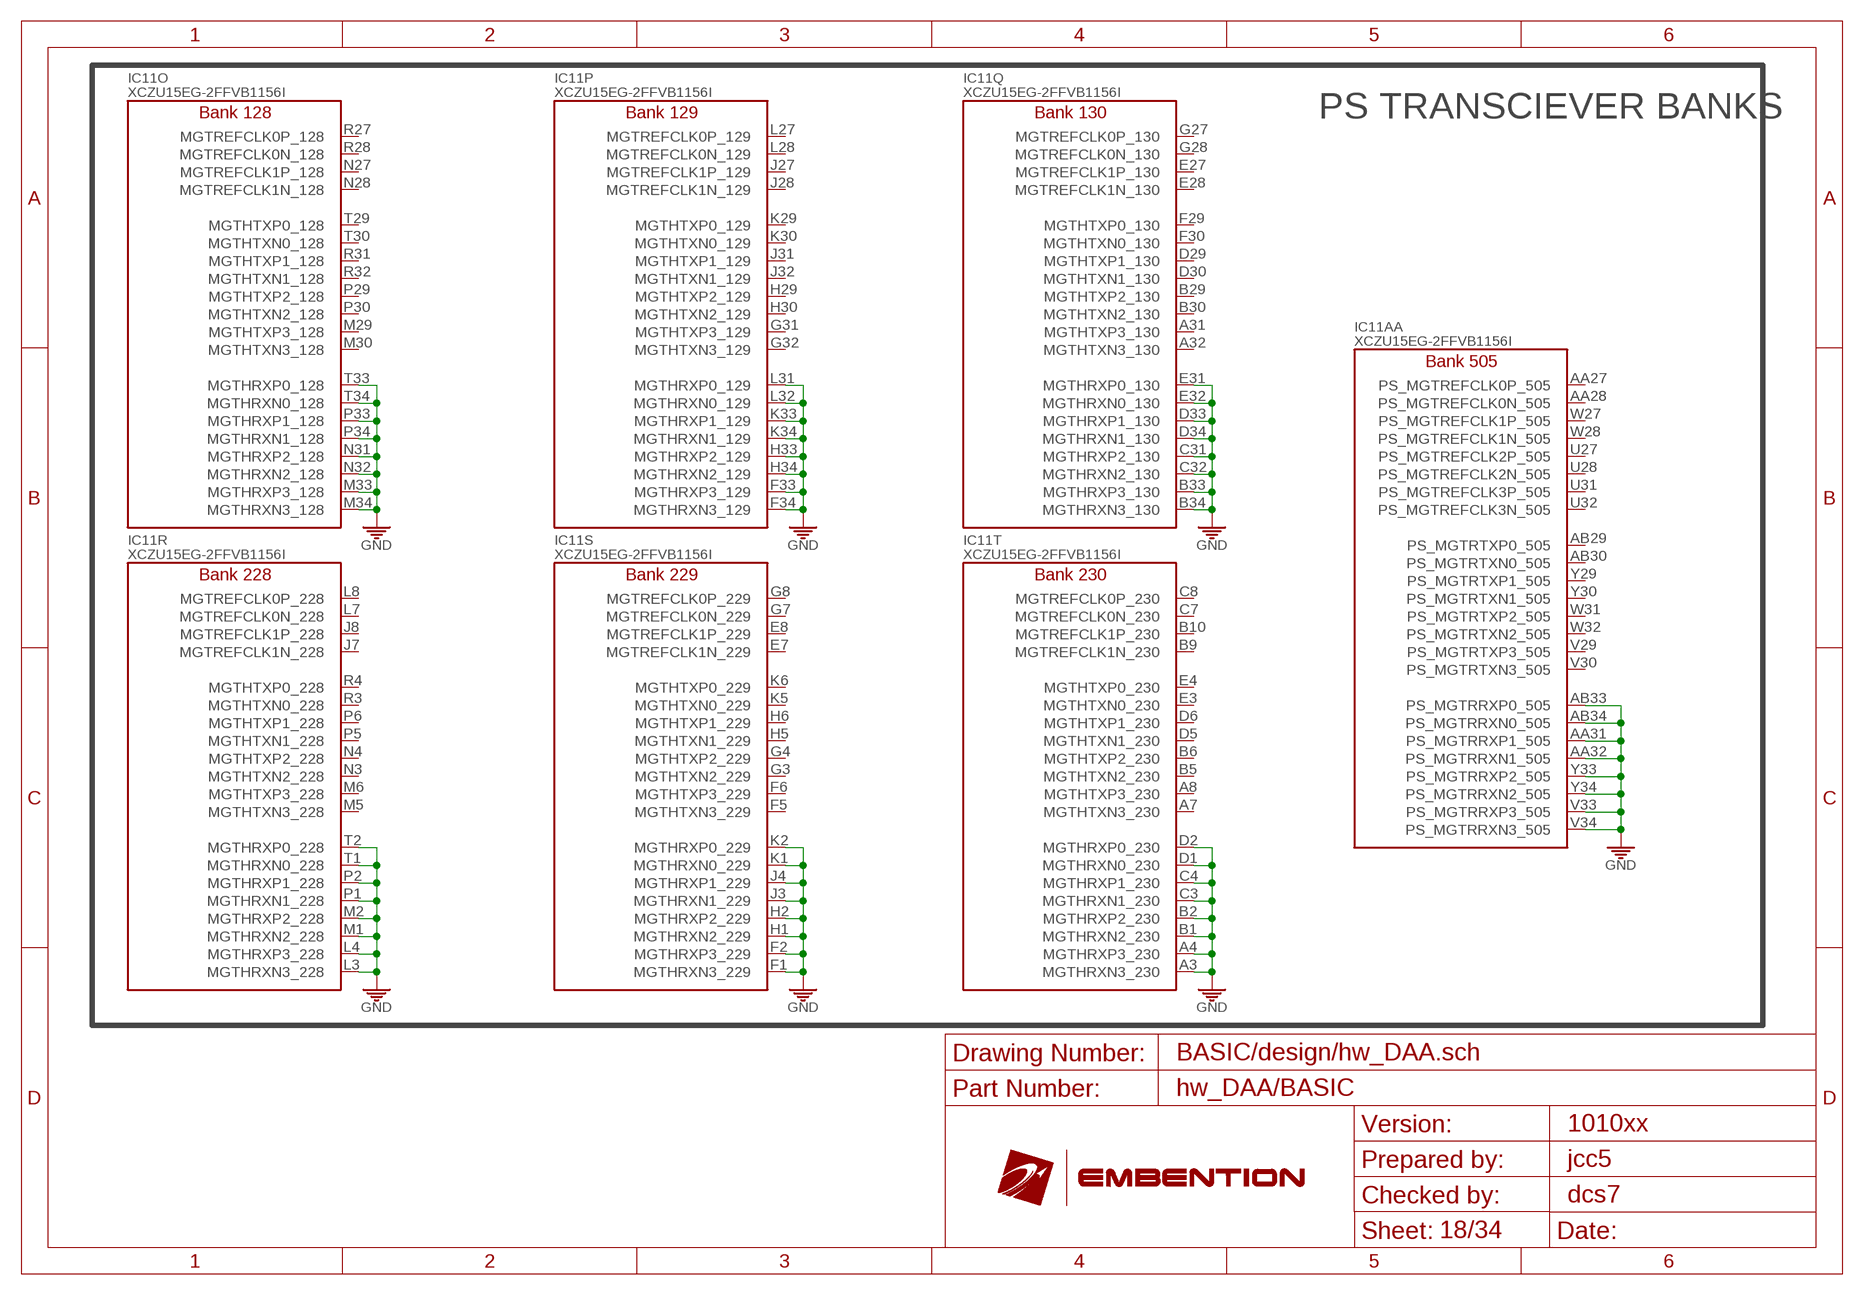
[diagram p17: schematic, sheet 18]

### Nets
GND: IC11.A3(T:MGTHRXN3_230) IC11.A4(T:MGTHRXP3_230) IC11.AA31(AA:PS_MGTRRXP1_505) IC11.AA32(AA:PS_MGTRRXN1_505) IC11.AB33(AA:PS_MGTRRXP0_505) IC11.AB34(AA:PS_MGTRRXN0_505) IC11.B1(T:MGTHRXN2_230) IC11.B2(T:MGTHRXP2_230) IC11.B33(Q:MGTHRXP3_130) IC11.B34(Q:MGTHRXN3_130) IC11.C3(T:MGTHRXN1_230) IC11.C4(T:MGTHRXP1_230) IC11.C31(Q:MGTHRXP2_130) IC11.C32(Q:MGTHRXN2_130) IC11.D1(T:MGTHRXN0_230) IC11.D2(T:MGTHRXP0_230) IC11.D33(Q:MGTHRXP1_130) IC11.D34(Q:MGTHRXN1_130) IC11.E31(Q:MGTHRXP0_130) IC11.E32(Q:MGTHRXN0_130) IC11.F1(S:MGTHRXN3_229) IC11.F2(S:MGTHRXP3_229) IC11.F33(P:MGTHRXP3_129) IC11.F34(P:MGTHRXN3_129) IC11.H1(S:MGTHRXN2_229) IC11.H2(S:MGTHRXP2_229) IC11.H33(P:MGTHRXP2_129) IC11.H34(P:MGTHRXN2_129) IC11.J3(S:MGTHRXN1_229) IC11.J4(S:MGTHRXP1_229) IC11.K1(S:MGTHRXN0_229) IC11.K2(S:MGTHRXP0_229) IC11.K33(P:MGTHRXP1_129) IC11.K34(P:MGTHRXN1_129) IC11.L3(R:MGTHRXN3_228) IC11.L4(R:MGTHRXP3_228) IC11.L31(P:MGTHRXP0_129) IC11.L32(P:MGTHRXN0_129) IC11.M1(R:MGTHRXN2_228) IC11.M2(R:MGTHRXP2_228) IC11.M33(O:MGTHRXP3_128) IC11.M34(O:MGTHRXN3_128) IC11.N31(O:MGTHRXP2_128) IC11.N32(O:MGTHRXN2_128) IC11.P1(R:MGTHRXN1_228) IC11.P2(R:MGTHRXP1_228) IC11.P33(O:MGTHRXP1_128) IC11.P34(O:MGTHRXN1_128) IC11.T1(R:MGTHRXN0_228) IC11.T2(R:MGTHRXP0_228) IC11.T33(O:MGTHRXP0_128) IC11.T34(O:MGTHRXN0_128) IC11.V33(AA:PS_MGTRRXP3_505) IC11.V34(AA:PS_MGTRRXN3_505) IC11.Y33(AA:PS_MGTRRXP2_505) IC11.Y34(AA:PS_MGTRRXN2_505) ; also sheet 2,3,4,5,6,7,8,9,10,11,12,13,14,15,17,20,21,22,23,24,25,26,27,28,29,30,31,32,33
Unconnected: IC11.A7(T:MGTHTXN3_230) IC11.A8(T:MGTHTXP3_230) IC11.A31(Q:MGTHTXP3_130) IC11.A32(Q:MGTHTXN3_130) IC11.AA27(AA:PS_MGTREFCLK0P_505) IC11.AA28(AA:PS_MGTREFCLK0N_505) IC11.AB29(AA:PS_MGTRTXP0_505) IC11.AB30(AA:PS_MGTRTXN0_505) IC11.B5(T:MGTHTXN2_230) IC11.B6(T:MGTHTXP2_230) IC11.B9(T:MGTREFCLK1N_230) IC11.B10(T:MGTREFCLK1P_230) IC11.B29(Q:MGTHTXP2_130) IC11.B30(Q:MGTHTXN2_130) IC11.C7(T:MGTREFCLK0N_230) IC11.C8(T:MGTREFCLK0P_230) IC11.D5(T:MGTHTXN1_230) IC11.D6(T:MGTHTXP1_230) IC11.D29(Q:MGTHTXP1_130) IC11.D30(Q:MGTHTXN1_130) IC11.E3(T:MGTHTXN0_230) IC11.E4(T:MGTHTXP0_230) IC11.E7(S:MGTREFCLK1N_229) IC11.E8(S:MGTREFCLK1P_229) IC11.E27(Q:MGTREFCLK1P_130) IC11.E28(Q:MGTREFCLK1N_130) IC11.F5(S:MGTHTXN3_229) IC11.F6(S:MGTHTXP3_229) IC11.F29(Q:MGTHTXP0_130) IC11.F30(Q:MGTHTXN0_130) IC11.G3(S:MGTHTXN2_229) IC11.G4(S:MGTHTXP2_229) IC11.G7(S:MGTREFCLK0N_229) IC11.G8(S:MGTREFCLK0P_229) IC11.G27(Q:MGTREFCLK0P_130) IC11.G28(Q:MGTREFCLK0N_130) IC11.G31(P:MGTHTXP3_129) IC11.G32(P:MGTHTXN3_129) IC11.H5(S:MGTHTXN1_229) IC11.H6(S:MGTHTXP1_229) IC11.H29(P:MGTHTXP2_129) IC11.H30(P:MGTHTXN2_129) IC11.J7(R:MGTREFCLK1N_228) IC11.J8(R:MGTREFCLK1P_228) IC11.J27(P:MGTREFCLK1P_129) IC11.J28(P:MGTREFCLK1N_129) IC11.J31(P:MGTHTXP1_129) IC11.J32(P:MGTHTXN1_129) IC11.K5(S:MGTHTXN0_229) IC11.K6(S:MGTHTXP0_229) IC11.K29(P:MGTHTXP0_129) IC11.K30(P:MGTHTXN0_129) IC11.L7(R:MGTREFCLK0N_228) IC11.L8(R:MGTREFCLK0P_228) IC11.L27(P:MGTREFCLK0P_129) IC11.L28(P:MGTREFCLK0N_129) IC11.M5(R:MGTHTXN3_228) IC11.M6(R:MGTHTXP3_228) IC11.M29(O:MGTHTXP3_128) IC11.M30(O:MGTHTXN3_128) IC11.N3(R:MGTHTXN2_228) IC11.N4(R:MGTHTXP2_228) IC11.N27(O:MGTREFCLK1P_128) IC11.N28(O:MGTREFCLK1N_128) IC11.P5(R:MGTHTXN1_228) IC11.P6(R:MGTHTXP1_228) IC11.P29(O:MGTHTXP2_128) IC11.P30(O:MGTHTXN2_128) IC11.R3(R:MGTHTXN0_228) IC11.R4(R:MGTHTXP0_228) IC11.R27(O:MGTREFCLK0P_128) IC11.R28(O:MGTREFCLK0N_128) IC11.R31(O:MGTHTXP1_128) IC11.R32(O:MGTHTXN1_128) IC11.T29(O:MGTHTXP0_128) IC11.T30(O:MGTHTXN0_128) IC11.U27(AA:PS_MGTREFCLK2P_505) IC11.U28(AA:PS_MGTREFCLK2N_505) IC11.U31(AA:PS_MGTREFCLK3P_505) IC11.U32(AA:PS_MGTREFCLK3N_505) IC11.V29(AA:PS_MGTRTXP3_505) IC11.V30(AA:PS_MGTRTXN3_505) IC11.W27(AA:PS_MGTREFCLK1P_505) IC11.W28(AA:PS_MGTREFCLK1N_505) IC11.W31(AA:PS_MGTRTXP2_505) IC11.W32(AA:PS_MGTRTXN2_505) IC11.Y29(AA:PS_MGTRTXP1_505) IC11.Y30(AA:PS_MGTRTXN1_505)

### Notes on the sheet
- PS TRANSCIEVER BANKS
- BASIC/design/hw_DAA.sch
- hw_DAA/BASIC
- 1010xx
- jcc5
- dcs7

## Sheet 19 of 34: PS MIO Banks
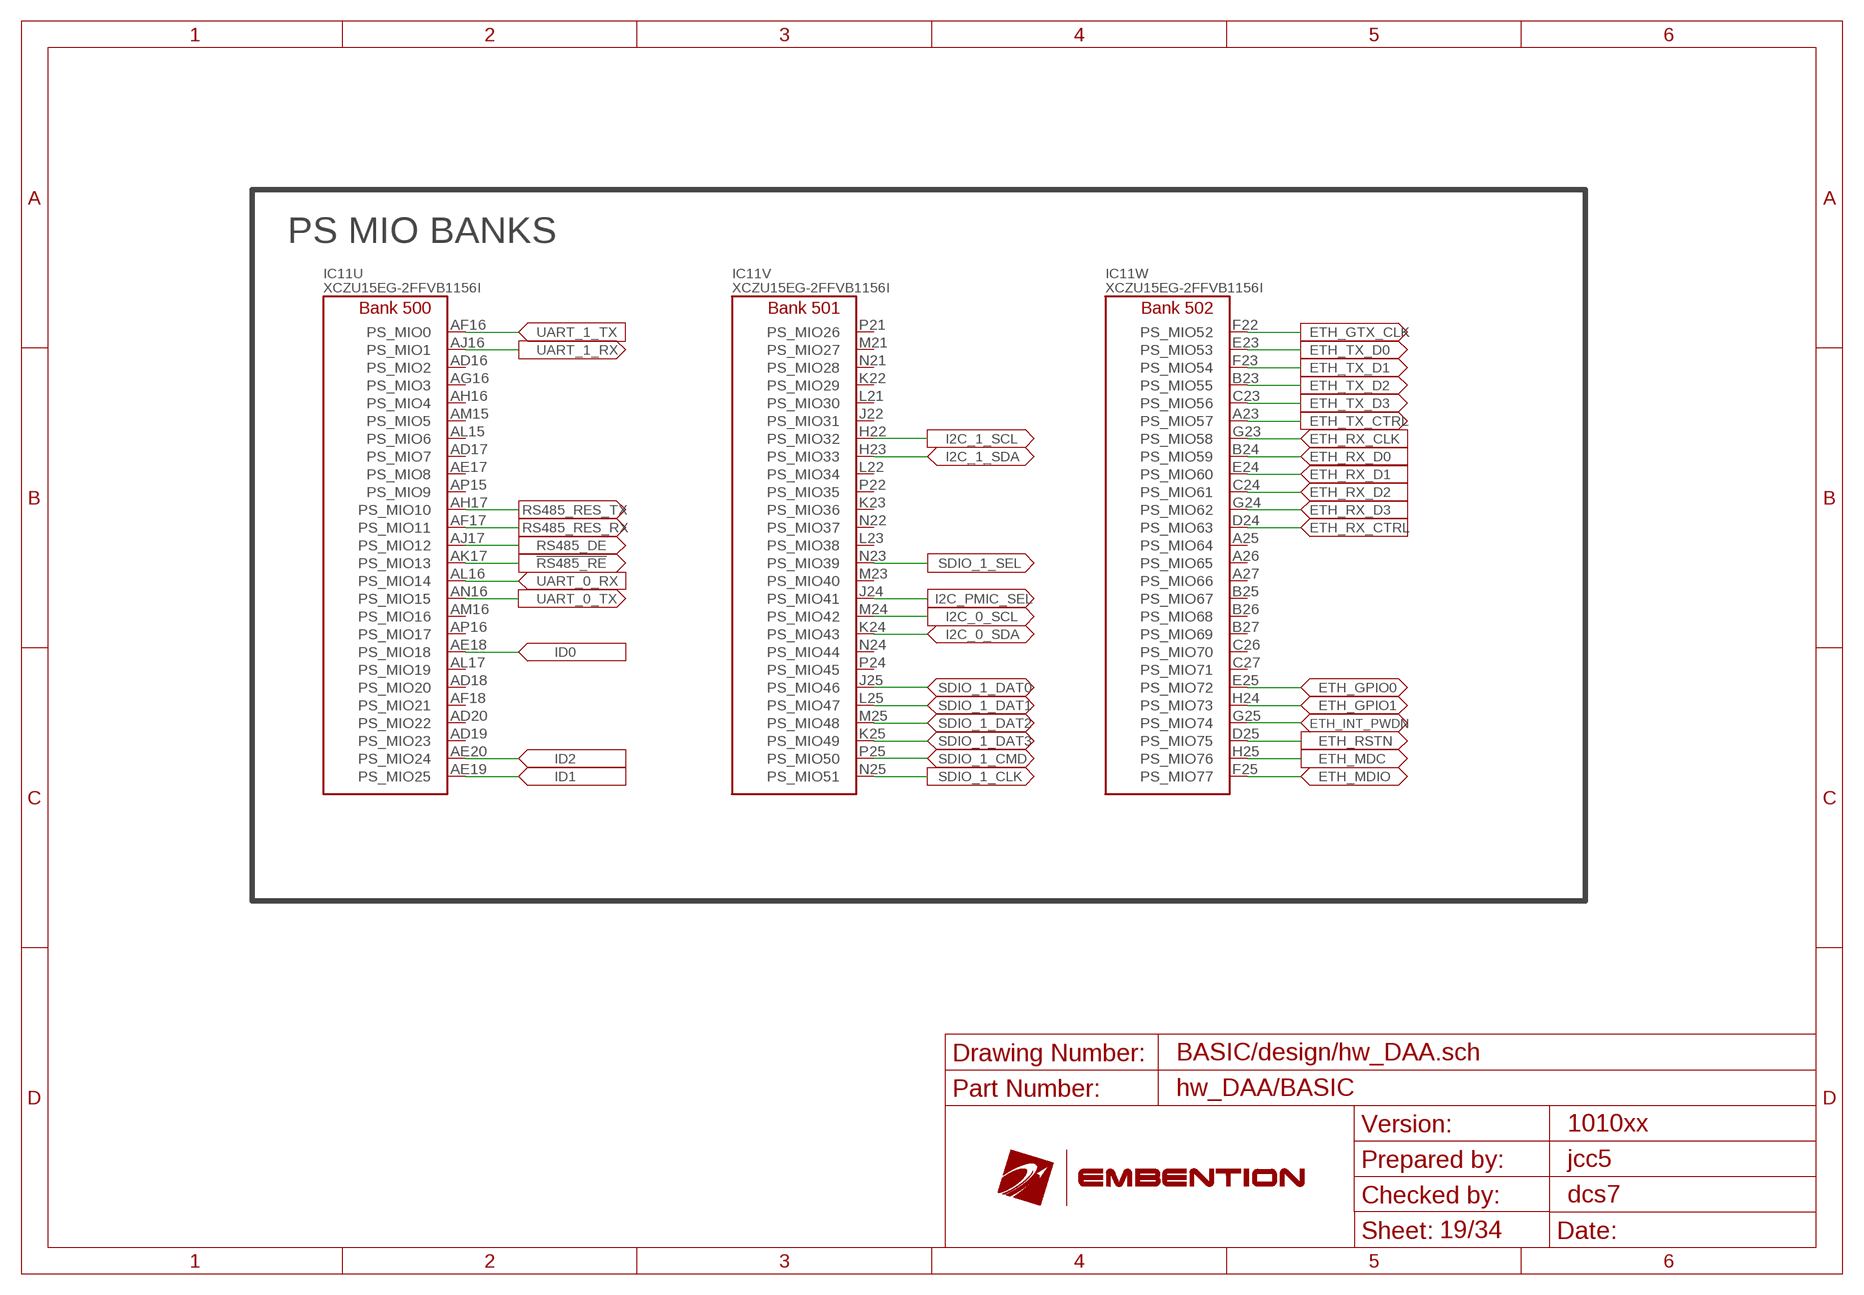
[diagram p18: schematic, sheet 19]

### Nets
!RS485_RE: IC11.AK17(U:PS_MIO13) ; also sheet 26
ETH_GPIO0: IC11.E25(W:PS_MIO72) ; also sheet 27
ETH_GPIO1: IC11.H24(W:PS_MIO73) ; also sheet 27
ETH_GTX_CLK: IC11.F22(W:PS_MIO52) ; also sheet 27
ETH_INT_PWDN: IC11.G25(W:PS_MIO74) ; also sheet 27
ETH_MDC: IC11.H25(W:PS_MIO76) ; also sheet 27
ETH_MDIO: IC11.F25(W:PS_MIO77) ; also sheet 27
ETH_RSTN: IC11.D25(W:PS_MIO75) ; also sheet 27
ETH_RX_CLK: IC11.G23(W:PS_MIO58) ; also sheet 27
ETH_RX_CTRL: IC11.D24(W:PS_MIO63) ; also sheet 27
ETH_RX_D0: IC11.B24(W:PS_MIO59) ; also sheet 27
ETH_RX_D1: IC11.E24(W:PS_MIO60) ; also sheet 27
ETH_RX_D2: IC11.C24(W:PS_MIO61) ; also sheet 27
ETH_RX_D3: IC11.G24(W:PS_MIO62) ; also sheet 27
ETH_TX_CTRL: IC11.A23(W:PS_MIO57) ; also sheet 27
ETH_TX_D0: IC11.E23(W:PS_MIO53) ; also sheet 27
ETH_TX_D1: IC11.F23(W:PS_MIO54) ; also sheet 27
ETH_TX_D2: IC11.B23(W:PS_MIO55) ; also sheet 27
ETH_TX_D3: IC11.C23(W:PS_MIO56) ; also sheet 27
I2C_0_SCL: IC11.M24(V:PS_MIO42) ; also sheet 6
I2C_0_SDA: IC11.K24(V:PS_MIO43) ; also sheet 6
I2C_1_SCL: IC11.H22(V:PS_MIO32) ; also sheet 15
I2C_1_SDA: IC11.H23(V:PS_MIO33) ; also sheet 15
I2C_PMIC_SEL: IC11.J24(V:PS_MIO41) ; also sheet 6
ID0: IC11.AE18(U:PS_MIO18) ; also sheet 14
ID1: IC11.AE19(U:PS_MIO25) ; also sheet 14
ID2: IC11.AE20(U:PS_MIO24) ; also sheet 14
RS485_DE: IC11.AJ17(U:PS_MIO12) ; also sheet 26
RS485_RES_RX: IC11.AF17(U:PS_MIO11) ; also sheet 26
RS485_RES_TX: IC11.AH17(U:PS_MIO10) ; also sheet 26
SDIO_1_CLK: IC11.N25(V:PS_MIO51) ; also sheet 24
SDIO_1_CMD: IC11.P25(V:PS_MIO50) ; also sheet 24
SDIO_1_DAT0: IC11.J25(V:PS_MIO46) ; also sheet 24
SDIO_1_DAT1: IC11.L25(V:PS_MIO47) ; also sheet 24
SDIO_1_DAT2: IC11.M25(V:PS_MIO48) ; also sheet 24
SDIO_1_DAT3: IC11.K25(V:PS_MIO49) ; also sheet 24
SDIO_1_SEL: IC11.N23(V:PS_MIO39) ; also sheet 24
UART_0_RX: IC11.AL16(U:PS_MIO14) ; also sheet 26
UART_0_TX: IC11.AN16(U:PS_MIO15) ; also sheet 26
UART_1_RX: IC11.AJ16(U:PS_MIO1) ; also sheet 26
UART_1_TX: IC11.AF16(U:PS_MIO0) ; also sheet 26
Unconnected: IC11.A25(W:PS_MIO64) IC11.A26(W:PS_MIO65) IC11.A27(W:PS_MIO66) IC11.AD16(U:PS_MIO2) IC11.AD17(U:PS_MIO7) IC11.AD18(U:PS_MIO20) IC11.AD19(U:PS_MIO23) IC11.AD20(U:PS_MIO22) IC11.AE17(U:PS_MIO8) IC11.AF18(U:PS_MIO21) IC11.AG16(U:PS_MIO3) IC11.AH16(U:PS_MIO4) IC11.AL15(U:PS_MIO6) IC11.AL17(U:PS_MIO19) IC11.AM15(U:PS_MIO5) IC11.AM16(U:PS_MIO16) IC11.AP15(U:PS_MIO9) IC11.AP16(U:PS_MIO17) IC11.B25(W:PS_MIO67) IC11.B26(W:PS_MIO68) IC11.B27(W:PS_MIO69) IC11.C26(W:PS_MIO70) IC11.C27(W:PS_MIO71) IC11.J22(V:PS_MIO31) IC11.K22(V:PS_MIO29) IC11.K23(V:PS_MIO36) IC11.L21(V:PS_MIO30) IC11.L22(V:PS_MIO34) IC11.L23(V:PS_MIO38) IC11.M21(V:PS_MIO27) IC11.M23(V:PS_MIO40) IC11.N21(V:PS_MIO28) IC11.N22(V:PS_MIO37) IC11.N24(V:PS_MIO44) IC11.P21(V:PS_MIO26) IC11.P22(V:PS_MIO35) IC11.P24(V:PS_MIO45)

### Notes on the sheet
- PS MIO BANKS
- BASIC/design/hw_DAA.sch
- hw_DAA/BASIC
- 1010xx
- jcc5
- dcs7

## Sheet 20 of 34: PS DDR Memory Bank
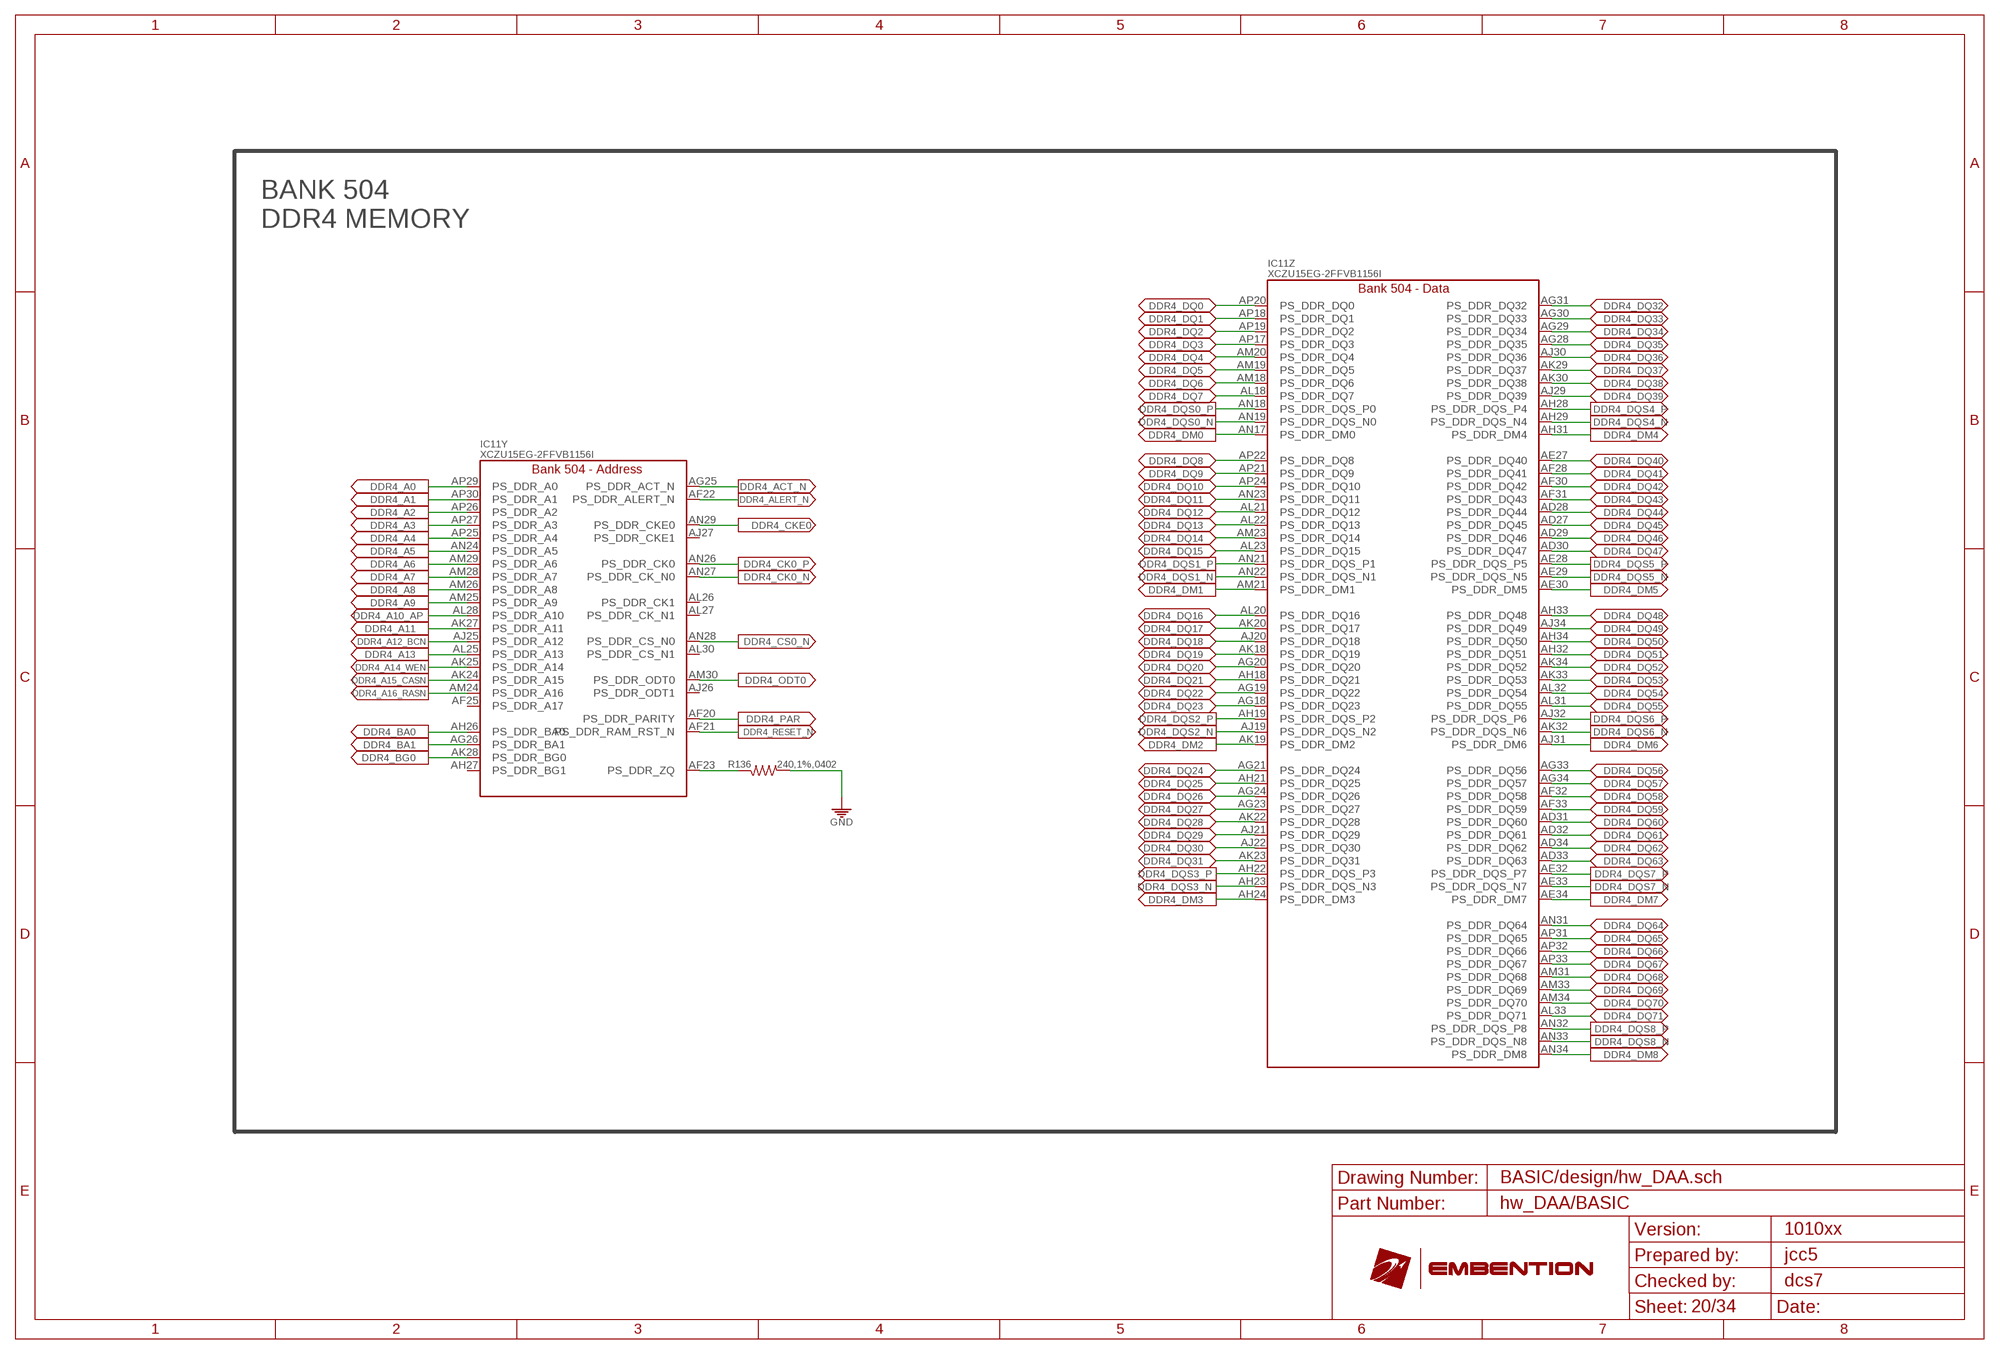
[diagram p19: schematic, sheet 20]

### Parts
R136  240,1%,0402  R_0402  [R0402]

### Nets
DDR4_A0 [DDR4_50]: IC11.AP29(Y:PS_DDR_A0) ; also sheet 21,22,23
DDR4_A1 [DDR4_50]: IC11.AP30(Y:PS_DDR_A1) ; also sheet 21,22,23
DDR4_A2 [DDR4_50]: IC11.AP26(Y:PS_DDR_A2) ; also sheet 21,22,23
DDR4_A3 [DDR4_50]: IC11.AP27(Y:PS_DDR_A3) ; also sheet 21,22,23
DDR4_A4 [DDR4_50]: IC11.AP25(Y:PS_DDR_A4) ; also sheet 21,22,23
DDR4_A5 [DDR4_50]: IC11.AN24(Y:PS_DDR_A5) ; also sheet 21,22,23
DDR4_A6 [DDR4_50]: IC11.AM29(Y:PS_DDR_A6) ; also sheet 21,22,23
DDR4_A7 [DDR4_50]: IC11.AM28(Y:PS_DDR_A7) ; also sheet 21,22,23
DDR4_A8 [DDR4_50]: IC11.AM26(Y:PS_DDR_A8) ; also sheet 21,22,23
DDR4_A9 [DDR4_50]: IC11.AM25(Y:PS_DDR_A9) ; also sheet 21,22,23
DDR4_A10_AP [DDR4_50]: IC11.AL28(Y:PS_DDR_A10) ; also sheet 21,22,23
DDR4_A11 [DDR4_50]: IC11.AK27(Y:PS_DDR_A11) ; also sheet 21,22,23
DDR4_A12_BCN [DDR4_50]: IC11.AJ25(Y:PS_DDR_A12) ; also sheet 21,22,23
DDR4_A13 [DDR4_50]: IC11.AL25(Y:PS_DDR_A13) ; also sheet 21,22,23
DDR4_A14_WEN [DDR4_50]: IC11.AK25(Y:PS_DDR_A14) ; also sheet 21,22,23
DDR4_A15_CASN [DDR4_50]: IC11.AK24(Y:PS_DDR_A15) ; also sheet 21,22,23
DDR4_A16_RASN [DDR4_50]: IC11.AM24(Y:PS_DDR_A16) ; also sheet 21,22,23
DDR4_ACT_N [DDR4_50]: IC11.AG25(Y:PS_DDR_ACT_N) ; also sheet 21,22,23
DDR4_ALERT_N [DDR4_50]: IC11.AF22(Y:PS_DDR_ALERT_N) ; also sheet 21,22,23
DDR4_BA0 [DDR4_50]: IC11.AH26(Y:PS_DDR_BA0) ; also sheet 21,22,23
DDR4_BA1 [DDR4_50]: IC11.AG26(Y:PS_DDR_BA1) ; also sheet 21,22,23
DDR4_BG0 [DDR4_50]: IC11.AK28(Y:PS_DDR_BG0) ; also sheet 21,22,23
DDR4_CK0_N [DDR4_90]: IC11.AN27(Y:PS_DDR_CK_N0) ; also sheet 21,22,23
DDR4_CK0_P [DDR4_90]: IC11.AN26(Y:PS_DDR_CK0) ; also sheet 21,22,23
DDR4_CKE0 [DDR4_50]: IC11.AN29(Y:PS_DDR_CKE0) ; also sheet 21,22,23
DDR4_CS0_N [DDR4_50]: IC11.AN28(Y:PS_DDR_CS_N0) ; also sheet 21,22,23
DDR4_DM0 [DDR4_50]: IC11.AN17(Z:PS_DDR_DM0) ; also sheet 21
DDR4_DM1 [DDR4_50]: IC11.AM21(Z:PS_DDR_DM1) ; also sheet 21
DDR4_DM2 [DDR4_50]: IC11.AK19(Z:PS_DDR_DM2) ; also sheet 21
DDR4_DM3 [DDR4_50]: IC11.AH24(Z:PS_DDR_DM3) ; also sheet 21
DDR4_DM4 [DDR4_50]: IC11.AH31(Z:PS_DDR_DM4) ; also sheet 22
DDR4_DM5 [DDR4_50]: IC11.AE30(Z:PS_DDR_DM5) ; also sheet 22
DDR4_DM6 [DDR4_50]: IC11.AJ31(Z:PS_DDR_DM6) ; also sheet 22
DDR4_DM7 [DDR4_50]: IC11.AE34(Z:PS_DDR_DM7) ; also sheet 22
DDR4_DM8 [DDR4_50]: IC11.AN34(Z:PS_DDR_DM8) ; also sheet 23
DDR4_DQ0 [DDR4_50]: IC11.AP20(Z:PS_DDR_DQ0) ; also sheet 21
DDR4_DQ1 [DDR4_50]: IC11.AP18(Z:PS_DDR_DQ1) ; also sheet 21
DDR4_DQ2 [DDR4_50]: IC11.AP19(Z:PS_DDR_DQ2) ; also sheet 21
DDR4_DQ3 [DDR4_50]: IC11.AP17(Z:PS_DDR_DQ3) ; also sheet 21
DDR4_DQ4 [DDR4_50]: IC11.AM20(Z:PS_DDR_DQ4) ; also sheet 21
DDR4_DQ5 [DDR4_50]: IC11.AM19(Z:PS_DDR_DQ5) ; also sheet 21
DDR4_DQ6 [DDR4_50]: IC11.AM18(Z:PS_DDR_DQ6) ; also sheet 21
DDR4_DQ7 [DDR4_50]: IC11.AL18(Z:PS_DDR_DQ7) ; also sheet 21
DDR4_DQ8 [DDR4_50]: IC11.AP22(Z:PS_DDR_DQ8) ; also sheet 21
DDR4_DQ9 [DDR4_50]: IC11.AP21(Z:PS_DDR_DQ9) ; also sheet 21
DDR4_DQ10 [DDR4_50]: IC11.AP24(Z:PS_DDR_DQ10) ; also sheet 21
DDR4_DQ11 [DDR4_50]: IC11.AN23(Z:PS_DDR_DQ11) ; also sheet 21
DDR4_DQ12 [DDR4_50]: IC11.AL21(Z:PS_DDR_DQ12) ; also sheet 21
DDR4_DQ13 [DDR4_50]: IC11.AL22(Z:PS_DDR_DQ13) ; also sheet 21
DDR4_DQ14 [DDR4_50]: IC11.AM23(Z:PS_DDR_DQ14) ; also sheet 21
DDR4_DQ15 [DDR4_50]: IC11.AL23(Z:PS_DDR_DQ15) ; also sheet 21
DDR4_DQ16 [DDR4_50]: IC11.AL20(Z:PS_DDR_DQ16) ; also sheet 21
DDR4_DQ17 [DDR4_50]: IC11.AK20(Z:PS_DDR_DQ17) ; also sheet 21
DDR4_DQ18 [DDR4_50]: IC11.AJ20(Z:PS_DDR_DQ18) ; also sheet 21
DDR4_DQ19 [DDR4_50]: IC11.AK18(Z:PS_DDR_DQ19) ; also sheet 21
DDR4_DQ20 [DDR4_50]: IC11.AG20(Z:PS_DDR_DQ20) ; also sheet 21
DDR4_DQ21 [DDR4_50]: IC11.AH18(Z:PS_DDR_DQ21) ; also sheet 21
DDR4_DQ22 [DDR4_50]: IC11.AG19(Z:PS_DDR_DQ22) ; also sheet 21
DDR4_DQ23 [DDR4_50]: IC11.AG18(Z:PS_DDR_DQ23) ; also sheet 21
DDR4_DQ24 [DDR4_50]: IC11.AG21(Z:PS_DDR_DQ24) ; also sheet 21
DDR4_DQ25 [DDR4_50]: IC11.AH21(Z:PS_DDR_DQ25) ; also sheet 21
DDR4_DQ26 [DDR4_50]: IC11.AG24(Z:PS_DDR_DQ26) ; also sheet 21
DDR4_DQ27 [DDR4_50]: IC11.AG23(Z:PS_DDR_DQ27) ; also sheet 21
DDR4_DQ28 [DDR4_50]: IC11.AK22(Z:PS_DDR_DQ28) ; also sheet 21
DDR4_DQ29 [DDR4_50]: IC11.AJ21(Z:PS_DDR_DQ29) ; also sheet 21
DDR4_DQ30 [DDR4_50]: IC11.AJ22(Z:PS_DDR_DQ30) ; also sheet 21
DDR4_DQ31 [DDR4_50]: IC11.AK23(Z:PS_DDR_DQ31) ; also sheet 21
DDR4_DQ32 [DDR4_50]: IC11.AG31(Z:PS_DDR_DQ32) ; also sheet 22
DDR4_DQ33 [DDR4_50]: IC11.AG30(Z:PS_DDR_DQ33) ; also sheet 22
DDR4_DQ34 [DDR4_50]: IC11.AG29(Z:PS_DDR_DQ34) ; also sheet 22
DDR4_DQ35 [DDR4_50]: IC11.AG28(Z:PS_DDR_DQ35) ; also sheet 22
DDR4_DQ36 [DDR4_50]: IC11.AJ30(Z:PS_DDR_DQ36) ; also sheet 22
DDR4_DQ37 [DDR4_50]: IC11.AK29(Z:PS_DDR_DQ37) ; also sheet 22
DDR4_DQ38 [DDR4_50]: IC11.AK30(Z:PS_DDR_DQ38) ; also sheet 22
DDR4_DQ39 [DDR4_50]: IC11.AJ29(Z:PS_DDR_DQ39) ; also sheet 22
DDR4_DQ40 [DDR4_50]: IC11.AE27(Z:PS_DDR_DQ40) ; also sheet 22
DDR4_DQ41 [DDR4_50]: IC11.AF28(Z:PS_DDR_DQ41) ; also sheet 22
DDR4_DQ42 [DDR4_50]: IC11.AF30(Z:PS_DDR_DQ42) ; also sheet 22
DDR4_DQ43 [DDR4_50]: IC11.AF31(Z:PS_DDR_DQ43) ; also sheet 22
DDR4_DQ44 [DDR4_50]: IC11.AD28(Z:PS_DDR_DQ44) ; also sheet 22
DDR4_DQ45 [DDR4_50]: IC11.AD27(Z:PS_DDR_DQ45) ; also sheet 22
DDR4_DQ46 [DDR4_50]: IC11.AD29(Z:PS_DDR_DQ46) ; also sheet 22
DDR4_DQ47 [DDR4_50]: IC11.AD30(Z:PS_DDR_DQ47) ; also sheet 22
DDR4_DQ48 [DDR4_50]: IC11.AH33(Z:PS_DDR_DQ48) ; also sheet 22
DDR4_DQ49 [DDR4_50]: IC11.AJ34(Z:PS_DDR_DQ49) ; also sheet 22
DDR4_DQ50 [DDR4_50]: IC11.AH34(Z:PS_DDR_DQ50) ; also sheet 22
DDR4_DQ51 [DDR4_50]: IC11.AH32(Z:PS_DDR_DQ51) ; also sheet 22
DDR4_DQ52 [DDR4_50]: IC11.AK34(Z:PS_DDR_DQ52) ; also sheet 22
DDR4_DQ53 [DDR4_50]: IC11.AK33(Z:PS_DDR_DQ53) ; also sheet 22
DDR4_DQ54 [DDR4_50]: IC11.AL32(Z:PS_DDR_DQ54) ; also sheet 22
DDR4_DQ55 [DDR4_50]: IC11.AL31(Z:PS_DDR_DQ55) ; also sheet 22
DDR4_DQ56 [DDR4_50]: IC11.AG33(Z:PS_DDR_DQ56) ; also sheet 22
DDR4_DQ57 [DDR4_50]: IC11.AG34(Z:PS_DDR_DQ57) ; also sheet 22
DDR4_DQ58 [DDR4_50]: IC11.AF32(Z:PS_DDR_DQ58) ; also sheet 22
DDR4_DQ59 [DDR4_50]: IC11.AF33(Z:PS_DDR_DQ59) ; also sheet 22
DDR4_DQ60 [DDR4_50]: IC11.AD31(Z:PS_DDR_DQ60) ; also sheet 22
DDR4_DQ61 [DDR4_50]: IC11.AD32(Z:PS_DDR_DQ61) ; also sheet 22
DDR4_DQ62 [DDR4_50]: IC11.AD34(Z:PS_DDR_DQ62) ; also sheet 22
DDR4_DQ63 [DDR4_50]: IC11.AD33(Z:PS_DDR_DQ63) ; also sheet 22
DDR4_DQ64 [DDR4_50]: IC11.AN31(Z:PS_DDR_DQ64) ; also sheet 23
DDR4_DQ65 [DDR4_50]: IC11.AP31(Z:PS_DDR_DQ65) ; also sheet 23
DDR4_DQ66 [DDR4_50]: IC11.AP32(Z:PS_DDR_DQ66) ; also sheet 23
DDR4_DQ67 [DDR4_50]: IC11.AP33(Z:PS_DDR_DQ67) ; also sheet 23
DDR4_DQ68 [DDR4_50]: IC11.AM31(Z:PS_DDR_DQ68) ; also sheet 23
DDR4_DQ69 [DDR4_50]: IC11.AM33(Z:PS_DDR_DQ69) ; also sheet 23
DDR4_DQ70 [DDR4_50]: IC11.AM34(Z:PS_DDR_DQ70) ; also sheet 23
DDR4_DQ71 [DDR4_50]: IC11.AL33(Z:PS_DDR_DQ71) ; also sheet 23
DDR4_DQS0_N [DDR4_90]: IC11.AN19(Z:PS_DDR_DQS_N0) ; also sheet 21
DDR4_DQS0_P [DDR4_90]: IC11.AN18(Z:PS_DDR_DQS_P0) ; also sheet 21
DDR4_DQS1_N [DDR4_90]: IC11.AN22(Z:PS_DDR_DQS_N1) ; also sheet 21
DDR4_DQS1_P [DDR4_90]: IC11.AN21(Z:PS_DDR_DQS_P1) ; also sheet 21
DDR4_DQS2_N [DDR4_90]: IC11.AJ19(Z:PS_DDR_DQS_N2) ; also sheet 21
DDR4_DQS2_P [DDR4_90]: IC11.AH19(Z:PS_DDR_DQS_P2) ; also sheet 21
DDR4_DQS3_N [DDR4_90]: IC11.AH23(Z:PS_DDR_DQS_N3) ; also sheet 21
DDR4_DQS3_P [DDR4_90]: IC11.AH22(Z:PS_DDR_DQS_P3) ; also sheet 21
DDR4_DQS4_N [DDR4_90]: IC11.AH29(Z:PS_DDR_DQS_N4) ; also sheet 22
DDR4_DQS4_P [DDR4_90]: IC11.AH28(Z:PS_DDR_DQS_P4) ; also sheet 22
DDR4_DQS5_N [DDR4_90]: IC11.AE29(Z:PS_DDR_DQS_N5) ; also sheet 22
DDR4_DQS5_P [DDR4_90]: IC11.AE28(Z:PS_DDR_DQS_P5) ; also sheet 22
DDR4_DQS6_N [DDR4_90]: IC11.AK32(Z:PS_DDR_DQS_N6) ; also sheet 22
DDR4_DQS6_P [DDR4_90]: IC11.AJ32(Z:PS_DDR_DQS_P6) ; also sheet 22
DDR4_DQS7_N [DDR4_90]: IC11.AE33(Z:PS_DDR_DQS_N7) ; also sheet 22
DDR4_DQS7_P [DDR4_90]: IC11.AE32(Z:PS_DDR_DQS_P7) ; also sheet 22
DDR4_DQS8_N [DDR4_90]: IC11.AN33(Z:PS_DDR_DQS_N8) ; also sheet 23
DDR4_DQS8_P [DDR4_90]: IC11.AN32(Z:PS_DDR_DQS_P8) ; also sheet 23
DDR4_ODT0 [DDR4_50]: IC11.AM30(Y:PS_DDR_ODT0) ; also sheet 21,22,23
DDR4_PAR [DDR4_50]: IC11.AF20(Y:PS_DDR_PARITY) ; also sheet 21,22,23
DDR4_RESET_N [DDR4_50]: IC11.AF21(Y:PS_DDR_RAM_RST_N) ; also sheet 21,22,23
DDR4_ZQ: IC11.AF23(Y:PS_DDR_ZQ) R136.2
GND: R136.1 ; also sheet 2,3,4,5,6,7,8,9,10,11,12,13,14,15,17,18,21,22,23,24,25,26,27,28,29,30,31,32,33
Unconnected: IC11.AF25(Y:PS_DDR_A17) IC11.AH27(Y:PS_DDR_BG1) IC11.AJ26(Y:PS_DDR_ODT1) IC11.AJ27(Y:PS_DDR_CKE1) IC11.AL26(Y:PS_DDR_CK1) IC11.AL27(Y:PS_DDR_CK_N1) IC11.AL30(Y:PS_DDR_CS_N1)

### Notes on the sheet
- BANK 504
  DDR4 MEMORY
- BASIC/design/hw_DAA.sch
- hw_DAA/BASIC
- 1010xx
- jcc5
- dcs7

## Sheet 21 of 34: DDR4 Memories 1-2
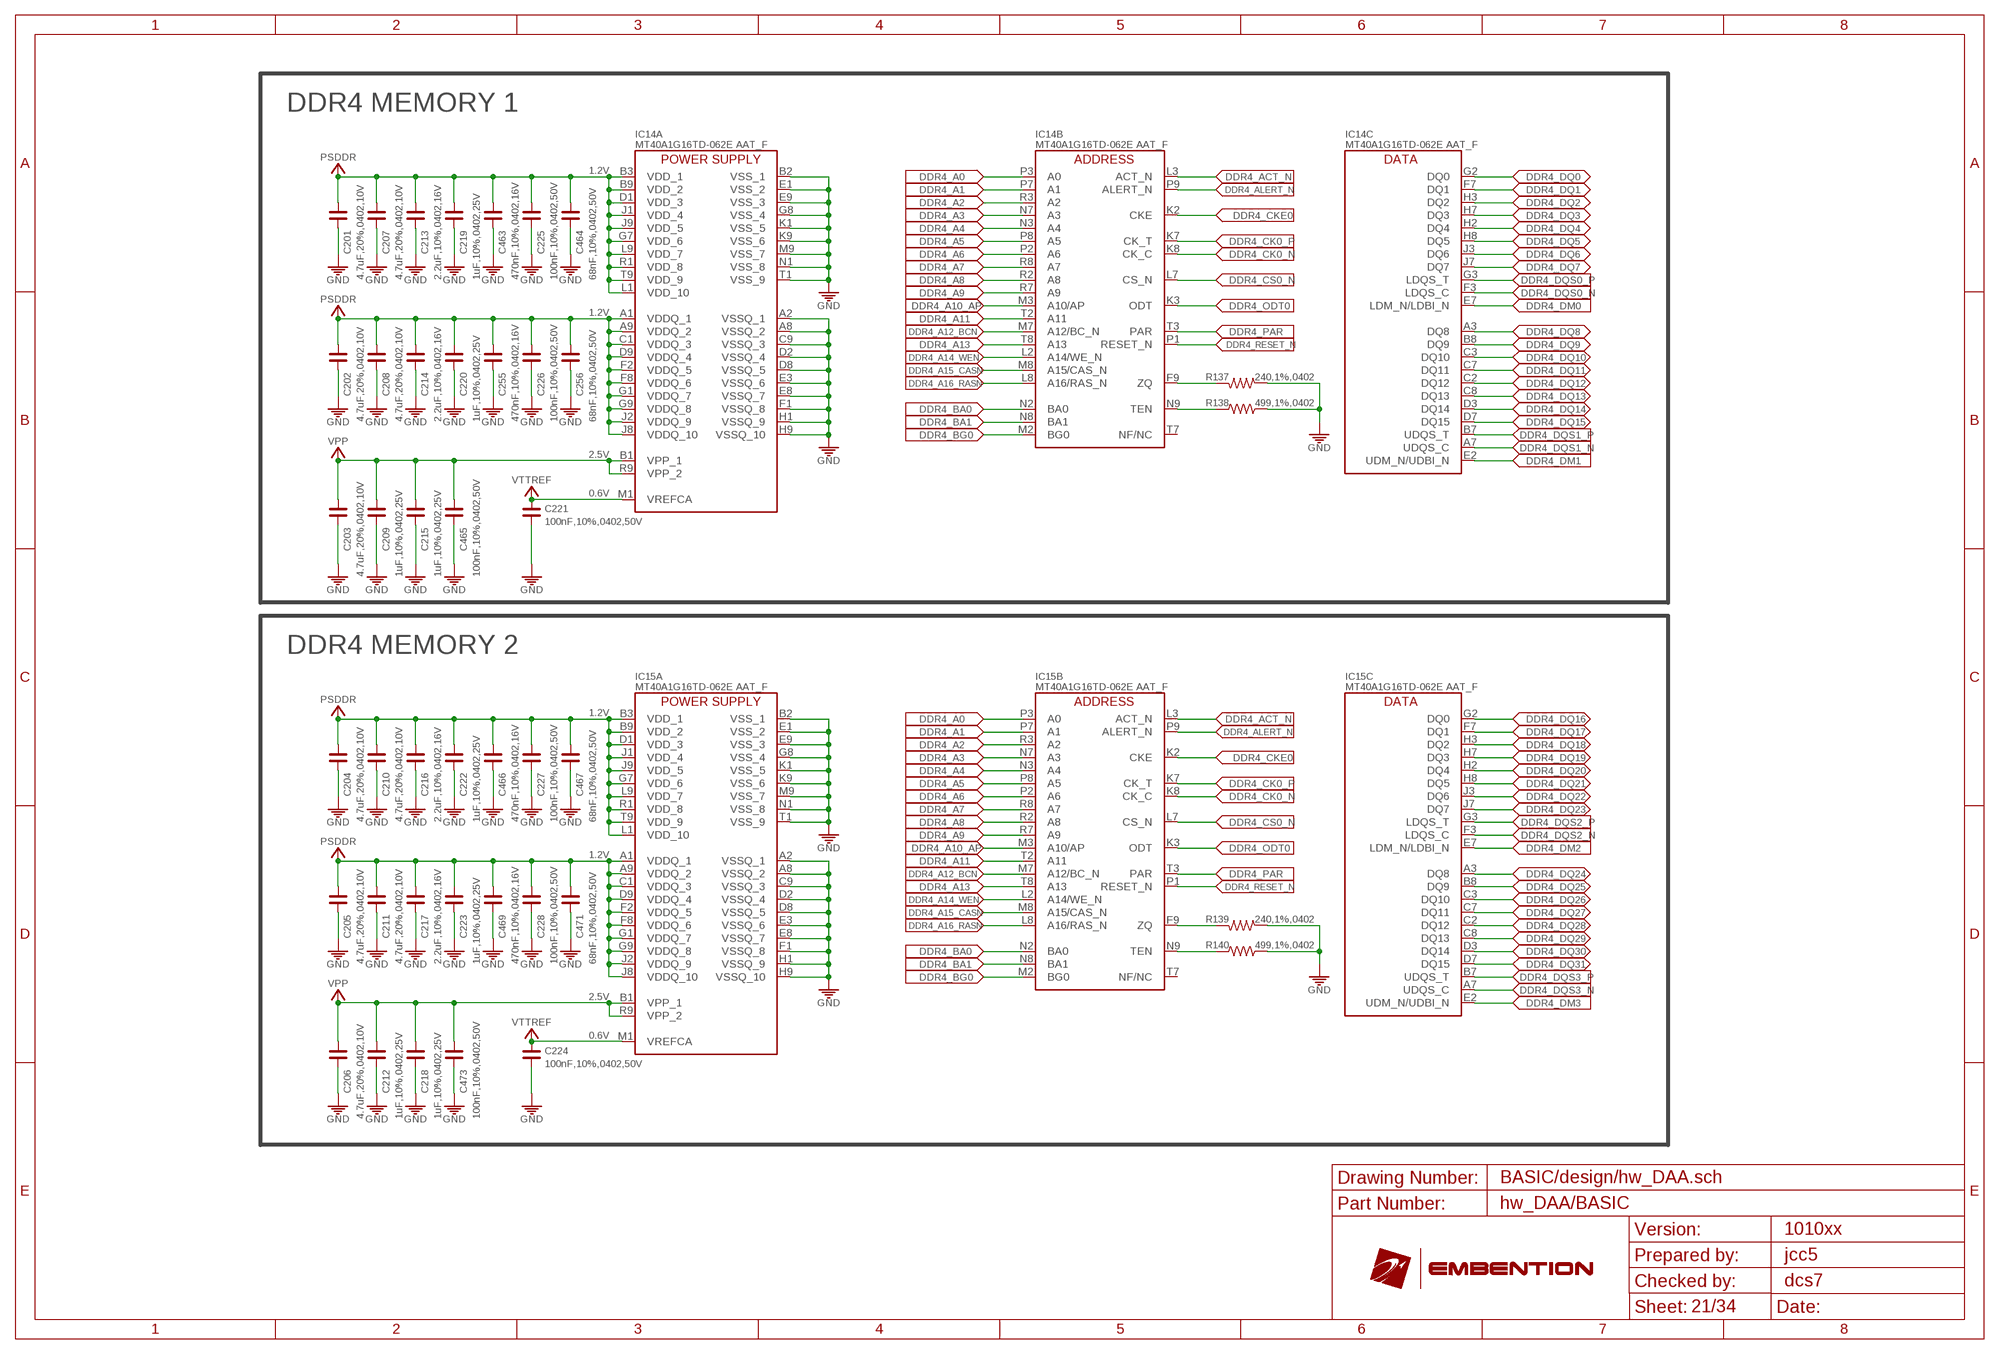
[diagram p20: schematic, sheet 21]

### Parts
C201  4.7uF,20%,0402,10V  C_0402  [C0402]
C202  4.7uF,20%,0402,10V  C_0402  [C0402]
C203  4.7uF,20%,0402,10V  C_0402  [C0402]
C204  4.7uF,20%,0402,10V  C_0402  [C0402]
C205  4.7uF,20%,0402,10V  C_0402  [C0402]
C206  4.7uF,20%,0402,10V  C_0402  [C0402]
C207  4.7uF,20%,0402,10V  C_0402  [C0402]
C208  4.7uF,20%,0402,10V  C_0402  [C0402]
C209  1uF,10%,0402,25V  C_0402  [C0402]
C210  4.7uF,20%,0402,10V  C_0402  [C0402]
C211  4.7uF,20%,0402,10V  C_0402  [C0402]
C212  1uF,10%,0402,25V  C_0402  [C0402]
C213  2.2uF,10%,0402,16V  C_0402  [C0402]
C214  2.2uF,10%,0402,16V  C_0402  [C0402]
C215  1uF,10%,0402,25V  C_0402  [C0402]
C216  2.2uF,10%,0402,16V  C_0402  [C0402]
C217  2.2uF,10%,0402,16V  C_0402  [C0402]
C218  1uF,10%,0402,25V  C_0402  [C0402]
C219  1uF,10%,0402,25V  C_0402  [C0402]
C220  1uF,10%,0402,25V  C_0402  [C0402]
C221  100nF,10%,0402,50V  C_0402  [C0402]
C222  1uF,10%,0402,25V  C_0402  [C0402]
C223  1uF,10%,0402,25V  C_0402  [C0402]
C224  100nF,10%,0402,50V  C_0402  [C0402]
C225  100nF,10%,0402,50V  C_0402  [C0402]
C226  100nF,10%,0402,50V  C_0402  [C0402]
C227  100nF,10%,0402,50V  C_0402  [C0402]
C228  100nF,10%,0402,50V  C_0402  [C0402]
C255  470nF,10%,0402,16V  C_0402  [C0402]
C256  68nF,10%,0402,50V  C_0402  [C0402]
C463  470nF,10%,0402,16V  C_0402  [C0402]
C464  68nF,10%,0402,50V  C_0402  [C0402]
C465  100nF,10%,0402,50V  C_0402  [C0402]
C466  470nF,10%,0402,16V  C_0402  [C0402]
C467  68nF,10%,0402,50V  C_0402  [C0402]
C469  470nF,10%,0402,16V  C_0402  [C0402]
C471  68nF,10%,0402,50V  C_0402  [C0402]
C473  100nF,10%,0402,50V  C_0402  [C0402]
IC14  MT40A1G16TD-062E AAT_F  MT40A1G16TD-062ENSMD  [FBGA96_NSMD_MICRON]
IC15  MT40A1G16TD-062E AAT_F  MT40A1G16TD-062ENSMD  [FBGA96_NSMD_MICRON]
R137  240,1%,0402  R_0402  [R0402]
R138  499,1%,0402  R_0402  [R0402]
R139  240,1%,0402  R_0402  [R0402]
R140  499,1%,0402  R_0402  [R0402]

### Nets
DDR4_A0 [DDR4_50]: IC14.P3(B:A0) IC15.P3(B:A0) ; also sheet 20,22,23
DDR4_A1 [DDR4_50]: IC14.P7(B:A1) IC15.P7(B:A1) ; also sheet 20,22,23
DDR4_A2 [DDR4_50]: IC14.R3(B:A2) IC15.R3(B:A2) ; also sheet 20,22,23
DDR4_A3 [DDR4_50]: IC14.N7(B:A3) IC15.N7(B:A3) ; also sheet 20,22,23
DDR4_A4 [DDR4_50]: IC14.N3(B:A4) IC15.N3(B:A4) ; also sheet 20,22,23
DDR4_A5 [DDR4_50]: IC14.P8(B:A5) IC15.P8(B:A5) ; also sheet 20,22,23
DDR4_A6 [DDR4_50]: IC14.P2(B:A6) IC15.P2(B:A6) ; also sheet 20,22,23
DDR4_A7 [DDR4_50]: IC14.R8(B:A7) IC15.R8(B:A7) ; also sheet 20,22,23
DDR4_A8 [DDR4_50]: IC14.R2(B:A8) IC15.R2(B:A8) ; also sheet 20,22,23
DDR4_A9 [DDR4_50]: IC14.R7(B:A9) IC15.R7(B:A9) ; also sheet 20,22,23
DDR4_A10_AP [DDR4_50]: IC14.M3(B:A10/AP) IC15.M3(B:A10/AP) ; also sheet 20,22,23
DDR4_A11 [DDR4_50]: IC14.T2(B:A11) IC15.T2(B:A11) ; also sheet 20,22,23
DDR4_A12_BCN [DDR4_50]: IC14.M7(B:A12/BC_N) IC15.M7(B:A12/BC_N) ; also sheet 20,22,23
DDR4_A13 [DDR4_50]: IC14.T8(B:A13) IC15.T8(B:A13) ; also sheet 20,22,23
DDR4_A14_WEN [DDR4_50]: IC14.L2(B:A14/WE_N) IC15.L2(B:A14/WE_N) ; also sheet 20,22,23
DDR4_A15_CASN [DDR4_50]: IC14.M8(B:A15/CAS_N) IC15.M8(B:A15/CAS_N) ; also sheet 20,22,23
DDR4_A16_RASN [DDR4_50]: IC14.L8(B:A16/RAS_N) IC15.L8(B:A16/RAS_N) ; also sheet 20,22,23
DDR4_ACT_N [DDR4_50]: IC14.L3(B:ACT_N) IC15.L3(B:ACT_N) ; also sheet 20,22,23
DDR4_ALERT_N [DDR4_50]: IC14.P9(B:ALERT_N) IC15.P9(B:ALERT_N) ; also sheet 20,22,23
DDR4_BA0 [DDR4_50]: IC14.N2(B:BA0) IC15.N2(B:BA0) ; also sheet 20,22,23
DDR4_BA1 [DDR4_50]: IC14.N8(B:BA1) IC15.N8(B:BA1) ; also sheet 20,22,23
DDR4_BG0 [DDR4_50]: IC14.M2(B:BG0) IC15.M2(B:BG0) ; also sheet 20,22,23
DDR4_CK0_N [DDR4_90]: IC14.K8(B:CK_C) IC15.K8(B:CK_C) ; also sheet 20,22,23
DDR4_CK0_P [DDR4_90]: IC14.K7(B:CK_T) IC15.K7(B:CK_T) ; also sheet 20,22,23
DDR4_CKE0 [DDR4_50]: IC14.K2(B:CKE) IC15.K2(B:CKE) ; also sheet 20,22,23
DDR4_CS0_N [DDR4_50]: IC14.L7(B:CS_N) IC15.L7(B:CS_N) ; also sheet 20,22,23
DDR4_DM0 [DDR4_50]: IC14.E7(C:LDM_N/LDBI_N) ; also sheet 20
DDR4_DM1 [DDR4_50]: IC14.E2(C:UDM_N/UDBI_N) ; also sheet 20
DDR4_DM2 [DDR4_50]: IC15.E7(C:LDM_N/LDBI_N) ; also sheet 20
DDR4_DM3 [DDR4_50]: IC15.E2(C:UDM_N/UDBI_N) ; also sheet 20
DDR4_DQ0 [DDR4_50]: IC14.G2(C:DQ0) ; also sheet 20
DDR4_DQ1 [DDR4_50]: IC14.F7(C:DQ1) ; also sheet 20
DDR4_DQ2 [DDR4_50]: IC14.H3(C:DQ2) ; also sheet 20
DDR4_DQ3 [DDR4_50]: IC14.H7(C:DQ3) ; also sheet 20
DDR4_DQ4 [DDR4_50]: IC14.H2(C:DQ4) ; also sheet 20
DDR4_DQ5 [DDR4_50]: IC14.H8(C:DQ5) ; also sheet 20
DDR4_DQ6 [DDR4_50]: IC14.J3(C:DQ6) ; also sheet 20
DDR4_DQ7 [DDR4_50]: IC14.J7(C:DQ7) ; also sheet 20
DDR4_DQ8 [DDR4_50]: IC14.A3(C:DQ8) ; also sheet 20
DDR4_DQ9 [DDR4_50]: IC14.B8(C:DQ9) ; also sheet 20
DDR4_DQ10 [DDR4_50]: IC14.C3(C:DQ10) ; also sheet 20
DDR4_DQ11 [DDR4_50]: IC14.C7(C:DQ11) ; also sheet 20
DDR4_DQ12 [DDR4_50]: IC14.C2(C:DQ12) ; also sheet 20
DDR4_DQ13 [DDR4_50]: IC14.C8(C:DQ13) ; also sheet 20
DDR4_DQ14 [DDR4_50]: IC14.D3(C:DQ14) ; also sheet 20
DDR4_DQ15 [DDR4_50]: IC14.D7(C:DQ15) ; also sheet 20
DDR4_DQ16 [DDR4_50]: IC15.G2(C:DQ0) ; also sheet 20
DDR4_DQ17 [DDR4_50]: IC15.F7(C:DQ1) ; also sheet 20
DDR4_DQ18 [DDR4_50]: IC15.H3(C:DQ2) ; also sheet 20
DDR4_DQ19 [DDR4_50]: IC15.H7(C:DQ3) ; also sheet 20
DDR4_DQ20 [DDR4_50]: IC15.H2(C:DQ4) ; also sheet 20
DDR4_DQ21 [DDR4_50]: IC15.H8(C:DQ5) ; also sheet 20
DDR4_DQ22 [DDR4_50]: IC15.J3(C:DQ6) ; also sheet 20
DDR4_DQ23 [DDR4_50]: IC15.J7(C:DQ7) ; also sheet 20
DDR4_DQ24 [DDR4_50]: IC15.A3(C:DQ8) ; also sheet 20
DDR4_DQ25 [DDR4_50]: IC15.B8(C:DQ9) ; also sheet 20
DDR4_DQ26 [DDR4_50]: IC15.C3(C:DQ10) ; also sheet 20
DDR4_DQ27 [DDR4_50]: IC15.C7(C:DQ11) ; also sheet 20
DDR4_DQ28 [DDR4_50]: IC15.C2(C:DQ12) ; also sheet 20
DDR4_DQ29 [DDR4_50]: IC15.C8(C:DQ13) ; also sheet 20
DDR4_DQ30 [DDR4_50]: IC15.D3(C:DQ14) ; also sheet 20
DDR4_DQ31 [DDR4_50]: IC15.D7(C:DQ15) ; also sheet 20
DDR4_DQS0_N [DDR4_90]: IC14.F3(C:LDQS_C) ; also sheet 20
DDR4_DQS0_P [DDR4_90]: IC14.G3(C:LDQS_T) ; also sheet 20
DDR4_DQS1_N [DDR4_90]: IC14.A7(C:UDQS_C) ; also sheet 20
DDR4_DQS1_P [DDR4_90]: IC14.B7(C:UDQS_T) ; also sheet 20
DDR4_DQS2_N [DDR4_90]: IC15.F3(C:LDQS_C) ; also sheet 20
DDR4_DQS2_P [DDR4_90]: IC15.G3(C:LDQS_T) ; also sheet 20
DDR4_DQS3_N [DDR4_90]: IC15.A7(C:UDQS_C) ; also sheet 20
DDR4_DQS3_P [DDR4_90]: IC15.B7(C:UDQS_T) ; also sheet 20
DDR4_ODT0 [DDR4_50]: IC14.K3(B:ODT) IC15.K3(B:ODT) ; also sheet 20,22,23
DDR4_PAR [DDR4_50]: IC14.T3(B:PAR) IC15.T3(B:PAR) ; also sheet 20,22,23
DDR4_RESET_N [DDR4_50]: IC14.P1(B:RESET_N) IC15.P1(B:RESET_N) ; also sheet 20,22,23
DDR4_TEN_0: IC14.N9(B:TEN) R138.1
DDR4_TEN_1: IC15.N9(B:TEN) R140.1
DDR4_ZQ_0: IC14.F9(B:ZQ) R137.2
DDR4_ZQ_1: IC15.F9(B:ZQ) R139.2
GND: C201.2 C202.2 C203.2 C204.2 C205.2 C206.2 C207.2 C208.2 C209.2 C210.2 C211.2 C212.2 C213.2 C214.2 C215.2 C216.2 C217.2 C218.2 C219.2 C220.2 C221.2 C222.2 C223.2 C224.2 C225.2 C226.2 C227.2 C228.2 C255.2 C256.2 C463.2 C464.2 C465.2 C466.2 C467.2 C469.2 C471.2 C473.2 IC14.A2(A:VSSQ_1) IC14.A8(A:VSSQ_2) IC14.B2(A:VSS_1) IC14.C9(A:VSSQ_3) IC14.D2(A:VSSQ_4) IC14.D8(A:VSSQ_5) IC14.E1(A:VSS_2) IC14.E3(A:VSSQ_6) IC14.E8(A:VSSQ_7) IC14.E9(A:VSS_3) IC14.F1(A:VSSQ_8) IC14.G8(A:VSS_4) IC14.H1(A:VSSQ_9) IC14.H9(A:VSSQ_10) IC14.K1(A:VSS_5) IC14.K9(A:VSS_6) IC14.M9(A:VSS_7) IC14.N1(A:VSS_8) IC14.T1(A:VSS_9) IC15.A2(A:VSSQ_1) IC15.A8(A:VSSQ_2) IC15.B2(A:VSS_1) IC15.C9(A:VSSQ_3) IC15.D2(A:VSSQ_4) IC15.D8(A:VSSQ_5) IC15.E1(A:VSS_2) IC15.E3(A:VSSQ_6) IC15.E8(A:VSSQ_7) IC15.E9(A:VSS_3) IC15.F1(A:VSSQ_8) IC15.G8(A:VSS_4) IC15.H1(A:VSSQ_9) IC15.H9(A:VSSQ_10) IC15.K1(A:VSS_5) IC15.K9(A:VSS_6) IC15.M9(A:VSS_7) IC15.N1(A:VSS_8) IC15.T1(A:VSS_9) R137.1 R138.2 R139.1 R140.2 ; also sheet 2,3,4,5,6,7,8,9,10,11,12,13,14,15,17,18,20,22,23,24,25,26,27,28,29,30,31,32,33
PSDDR: C201.1 C202.1 C204.1 C205.1 C207.1 C208.1 C210.1 C211.1 C213.1 C214.1 C216.1 C217.1 C219.1 C220.1 C222.1 C223.1 C225.1 C226.1 C227.1 C228.1 C255.1 C256.1 C463.1 C464.1 C466.1 C467.1 C469.1 C471.1 IC14.A1(A:VDDQ_1) IC14.A9(A:VDDQ_2) IC14.B3(A:VDD_1) IC14.B9(A:VDD_2) IC14.C1(A:VDDQ_3) IC14.D1(A:VDD_3) IC14.D9(A:VDDQ_4) IC14.F2(A:VDDQ_5) IC14.F8(A:VDDQ_6) IC14.G1(A:VDDQ_7) IC14.G7(A:VDD_6) IC14.G9(A:VDDQ_8) IC14.J1(A:VDD_4) IC14.J2(A:VDDQ_9) IC14.J8(A:VDDQ_10) IC14.J9(A:VDD_5) IC14.L1(A:VDD_10) IC14.L9(A:VDD_7) IC14.R1(A:VDD_8) IC14.T9(A:VDD_9) IC15.A1(A:VDDQ_1) IC15.A9(A:VDDQ_2) IC15.B3(A:VDD_1) IC15.B9(A:VDD_2) IC15.C1(A:VDDQ_3) IC15.D1(A:VDD_3) IC15.D9(A:VDDQ_4) IC15.F2(A:VDDQ_5) IC15.F8(A:VDDQ_6) IC15.G1(A:VDDQ_7) IC15.G7(A:VDD_6) IC15.G9(A:VDDQ_8) IC15.J1(A:VDD_4) IC15.J2(A:VDDQ_9) IC15.J8(A:VDDQ_10) IC15.J9(A:VDD_5) IC15.L1(A:VDD_10) IC15.L9(A:VDD_7) IC15.R1(A:VDD_8) IC15.T9(A:VDD_9) ; also sheet 8,12,22,23
VPP: C203.1 C206.1 C209.1 C212.1 C215.1 C218.1 C465.1 C473.1 IC14.B1(A:VPP_1) IC14.R9(A:VPP_2) IC15.B1(A:VPP_1) IC15.R9(A:VPP_2) ; also sheet 8,22,23
VTTREF: C221.1 C224.1 IC14.M1(A:VREFCA) IC15.M1(A:VREFCA) ; also sheet 8,22,23
Unconnected: IC14.T7(B:NF/NC) IC15.T7(B:NF/NC)

### Notes on the sheet
- DDR4 MEMORY 1
- 1.2V
- 1.2V
- 2.5V
- 0.6V
- DDR4 MEMORY 2
- 1.2V
- 1.2V
- 2.5V
- 0.6V
- BASIC/design/hw_DAA.sch
- hw_DAA/BASIC
- 1010xx
- jcc5
- dcs7